# EAGLE design CANTensegrityBoard (EAGLE 6.4)

## Sheet 1 of 6
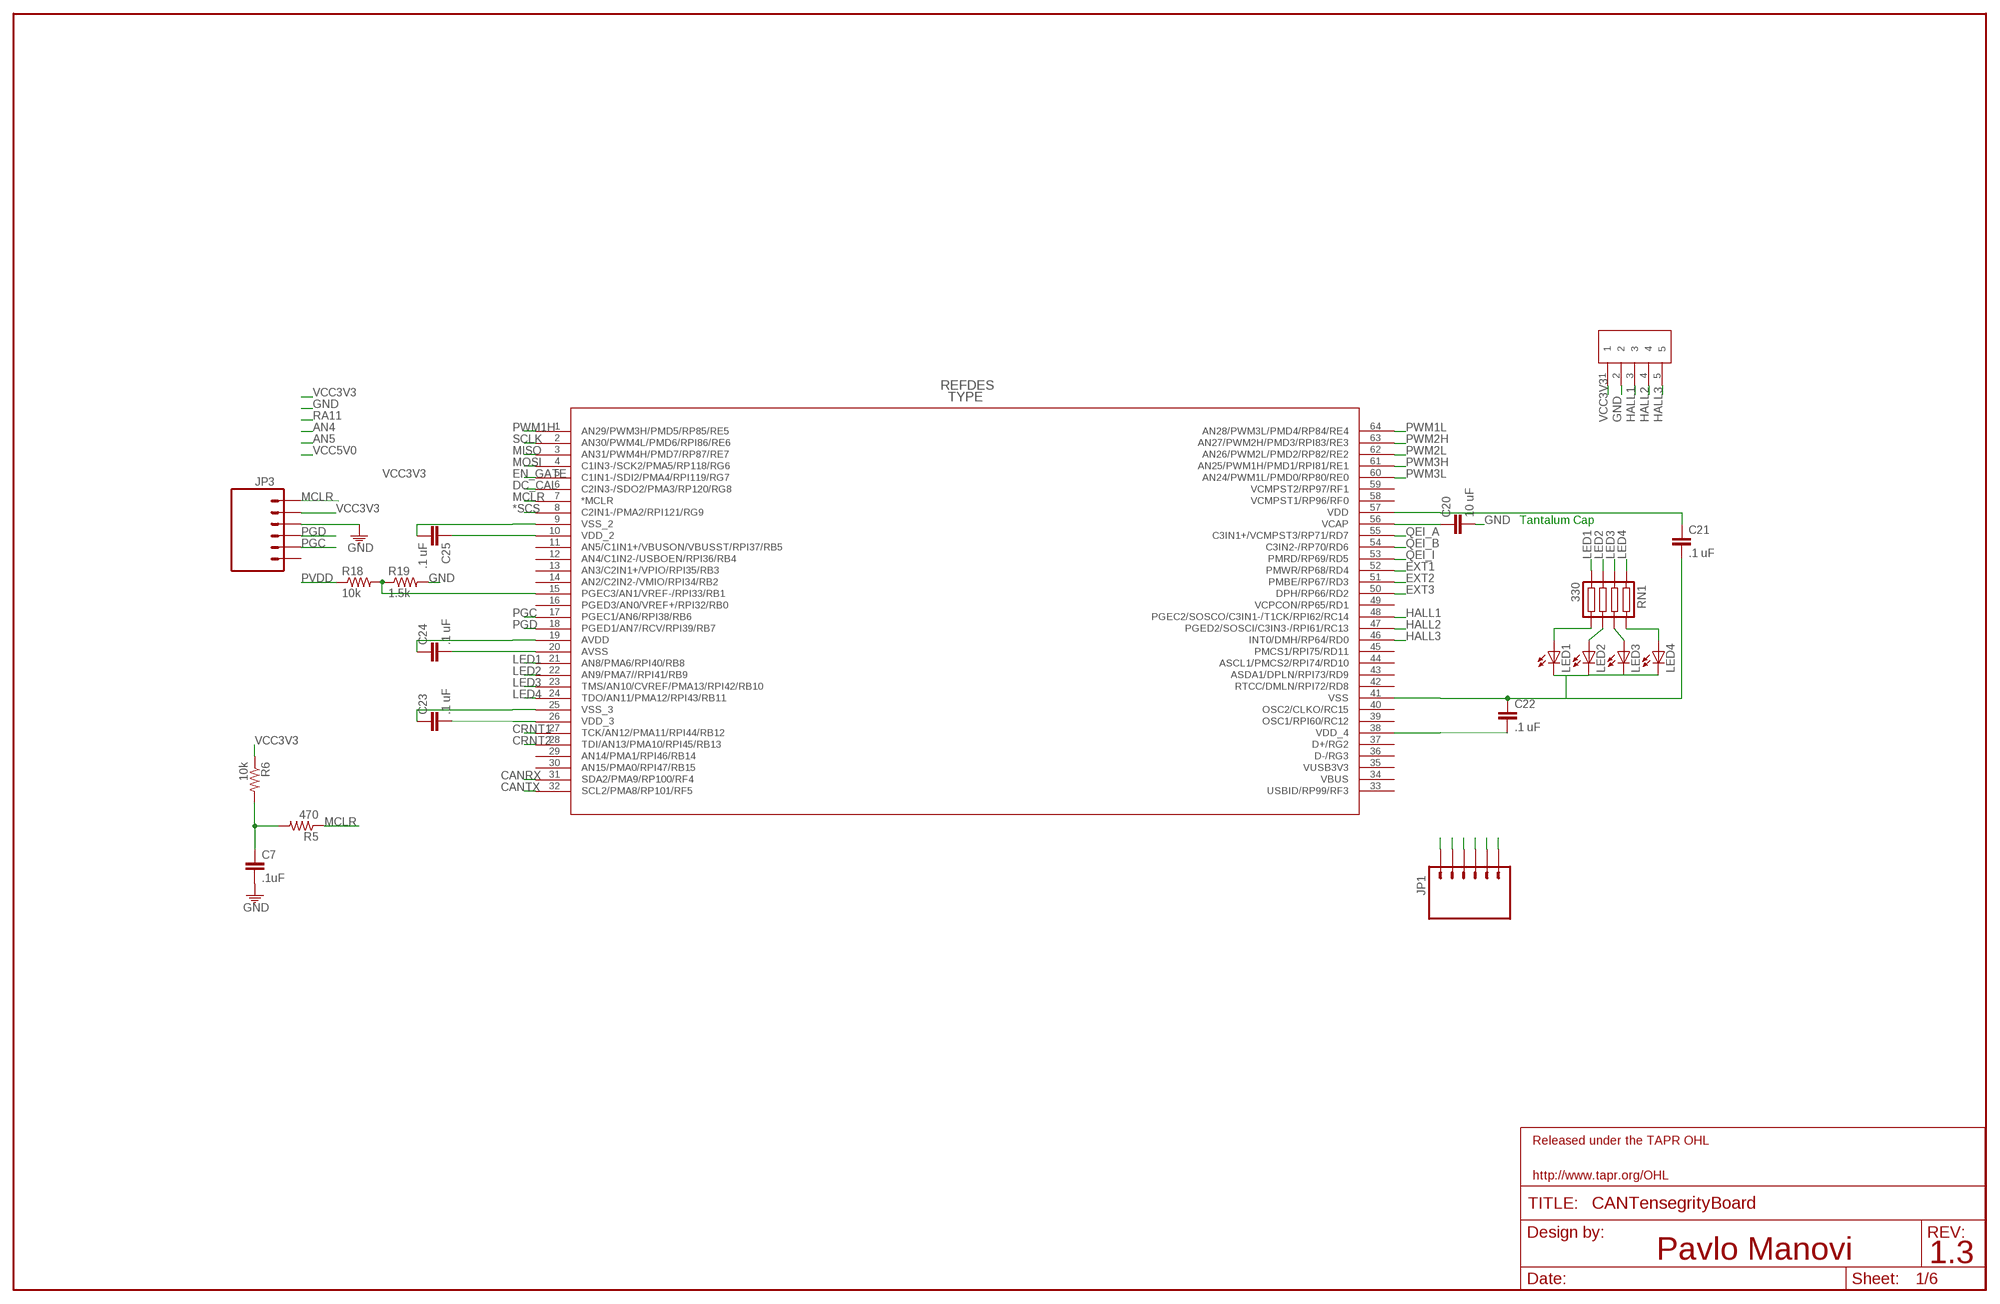
[diagram p0: schematic, sheet 1]

### Parts
C7  .1uF  CAP0805  [0805]
C20  10 uF  CAP1206  [1206]
C21  .1 uF  CAP0805  [0805]
C22  .1 uF  CAP0805  [0805]
C23  .1 uF  CAP0805  [0805]
C24  .1 uF  CAP0805  [0805]
C25  .1 uF  CAP0805  [0805]
JP1  M06DUAL_ROW  [2X03]
JP3  M06LOCK  [1X06_LOCK]
LED1  LED0805  [LED-0805]
LED2  LED0805  [LED-0805]
LED3  LED0805  [LED-0805]
LED4  LED0805  [LED-0805]
R5  470  RESISTOR0805-RES  [0805]
R6  10k  RESISTOR0805-RES  [0805]
R18  10k  RESISTOR0805-RES  [0805]
R19  1.5k  RESISTOR0805-RES  [0805]
RN1  330  RESISTOR_ARRAY-4  [EXB-38V271JV]
U6  DSPIC33EP256MU80  [QFP64-10X10MC]
U$20  MICROCLASP5  [55932-0510]

### Nets
*SCS [Power]: U6.8(C2IN1-/PMA2/RPI121/RG9) ; also sheet 2
CANRX: U6.31(SDA2/PMA9/RP100/RF4) ; also sheet 4
CANTX: U6.32(SCL2/PMA8/RP101/RF5) ; also sheet 4
CRNT1: U6.27(TCK/AN12/PMA11/RPI44/RB12) ; also sheet 2
CRNT2: U6.28(TDI/AN13/PMA10/RPI45/RB13) ; also sheet 2
DC_CAL: U6.6(C2IN3-/SDO2/PMA3/RP120/RG8) ; also sheet 2
EN_GATE: U6.5(C1IN1-/SDI2/PMA4/RPI119/RG7) ; also sheet 2
EXT1: JP1.1 U6.52(PMWR/RP68/RD4)
EXT2: JP1.2 U6.51(PMBE/RP67/RD3)
EXT3: JP1.3 U6.50(DPH/RP66/RD2)
GND: C7.2 C20.2 C21.2 C22.1 C23.1 C24.2 C25.2 JP1.4 JP3.3 LED1.2(C) LED2.2(C) LED3.2(C) LED4.2(C) R19.2 U6.9(VSS_2) U6.20(AVSS) U6.25(VSS_3) U6.41(VSS) U$20.2 ; also sheet 3,4,6
HALL1: U6.48(PGEC2/SOSCO/C3IN1-/T1CK/RPI62/RC14) U$20.3
HALL2: U6.47(PGED2/SOSCI/C3IN3-/RPI61/RC13) U$20.4
HALL3: U6.46(INT0/DMH/RP64/RD0) U$20.5
LED1: RN1.P$4 U6.21(AN8/PMA6/RPI40/RB8)
LED2: RN1.P$3 U6.22(AN9/PMA7//RPI41/RB9)
LED3: RN1.P$2 U6.23(TMS/AN10/CVREF/PMA13/RPI42/RB10)
LED4: RN1.P$1 U6.24(TDO/AN11/PMA12/RPI43/RB11)
MCLR: JP3.1 R5.1 U6.7(*MCLR)
MISO: U6.3(AN31/PWM4H/PMD7/RP87/RE7) ; also sheet 2
MOSI: U6.4(C1IN3-/SCK2/PMA5/RP118/RG6) ; also sheet 2
N$2: C7.1 R5.2 R6.2
N$25: R18.2 R19.1 U6.15(PGEC3/AN1/VREF-/RPI33/RB1)
N$31: C20.1 U6.56(VCAP)
N$44: LED1.1(A) RN1.P$5
N$45: LED2.1(A) RN1.P$6
N$46: LED3.1(A) RN1.P$7
N$47: LED4.1(A) RN1.P$8
PGC: JP3.5 U6.17(PGEC1/AN6/RPI38/RB6)
PGD [small]: JP3.4 U6.18(PGED1/AN7/RCV/RPI39/RB7)
PVDD [Power]: R18.1 ; also sheet 2,3,5
PWM1H: U6.1(AN29/PWM3H/PMD5/RP85/RE5) ; also sheet 2
PWM1L: U6.64(AN28/PWM3L/PMD4/RP84/RE4) ; also sheet 2
PWM2H: U6.63(AN27/PWM2H/PMD3/RPI83/RE3) ; also sheet 2
PWM2L: U6.62(AN26/PWM2L/PMD2/RP82/RE2) ; also sheet 2
PWM3H: U6.61(AN25/PWM1H/PMD1/RPI81/RE1) ; also sheet 2
PWM3L: U6.60(AN24/PWM1L/PMD0/RP80/RE0) ; also sheet 2
QEI_A: U6.55(C3IN1+/VCMPST3/RP71/RD7) ; also sheet 6
QEI_B: U6.54(C3IN2-/RP70/RD6) ; also sheet 6
QEI_I: U6.53(PMRD/RP69/RD5) ; also sheet 6
SCLK: U6.2(AN30/PWM4L/PMD6/RPI86/RE6) ; also sheet 2
VCC3V3 [Power]: C21.1 C22.2 C23.2 C24.1 C25.1 JP1.6 JP3.2 R6.1 U6.10(VDD_2) U6.19(AVDD) U6.26(VDD_3) U6.38(VDD_4) U6.57(VDD) U$20.1 ; also sheet 2,4,5,6
VCC5V0: JP1.5 ; also sheet 5,6
Unconnected: JP3.6 U6.11(AN5/C1IN1+/VBUSON/VBUSST/RPI37/RB5) U6.12(AN4/C1IN2-/USBOEN/RPI36/RB4) U6.13(AN3/C2IN1+/VPIO/RPI35/RB3) U6.14(AN2/C2IN2-/VMIO/RPI34/RB2) U6.16(PGED3/AN0/VREF+/RPI32/RB0) U6.29(AN14/PMA1/RPI46/RB14) U6.30(AN15/PMA0/RPI47/RB15) U6.33(USBID/RP99/RF3) U6.34(VBUS) U6.35(VUSB3V3) U6.36(D-/RG3) U6.37(D+/RG2) U6.39(OSC1/RPI60/RC12) U6.40(OSC2/CLKO/RC15) U6.42(RTCC/DMLN/RPI72/RD8) U6.43(ASDA1/DPLN/RPI73/RD9) U6.44(ASCL1/PMCS2/RPI74/RD10) U6.45(PMCS1/RPI75/RD11) U6.49(VCPCON/RP65/RD1) U6.58(VCMPST1/RP96/RF0) U6.59(VCMPST2/RP97/RF1)

### Notes on the sheet
- Tantalum Cap

## Sheet 2 of 6
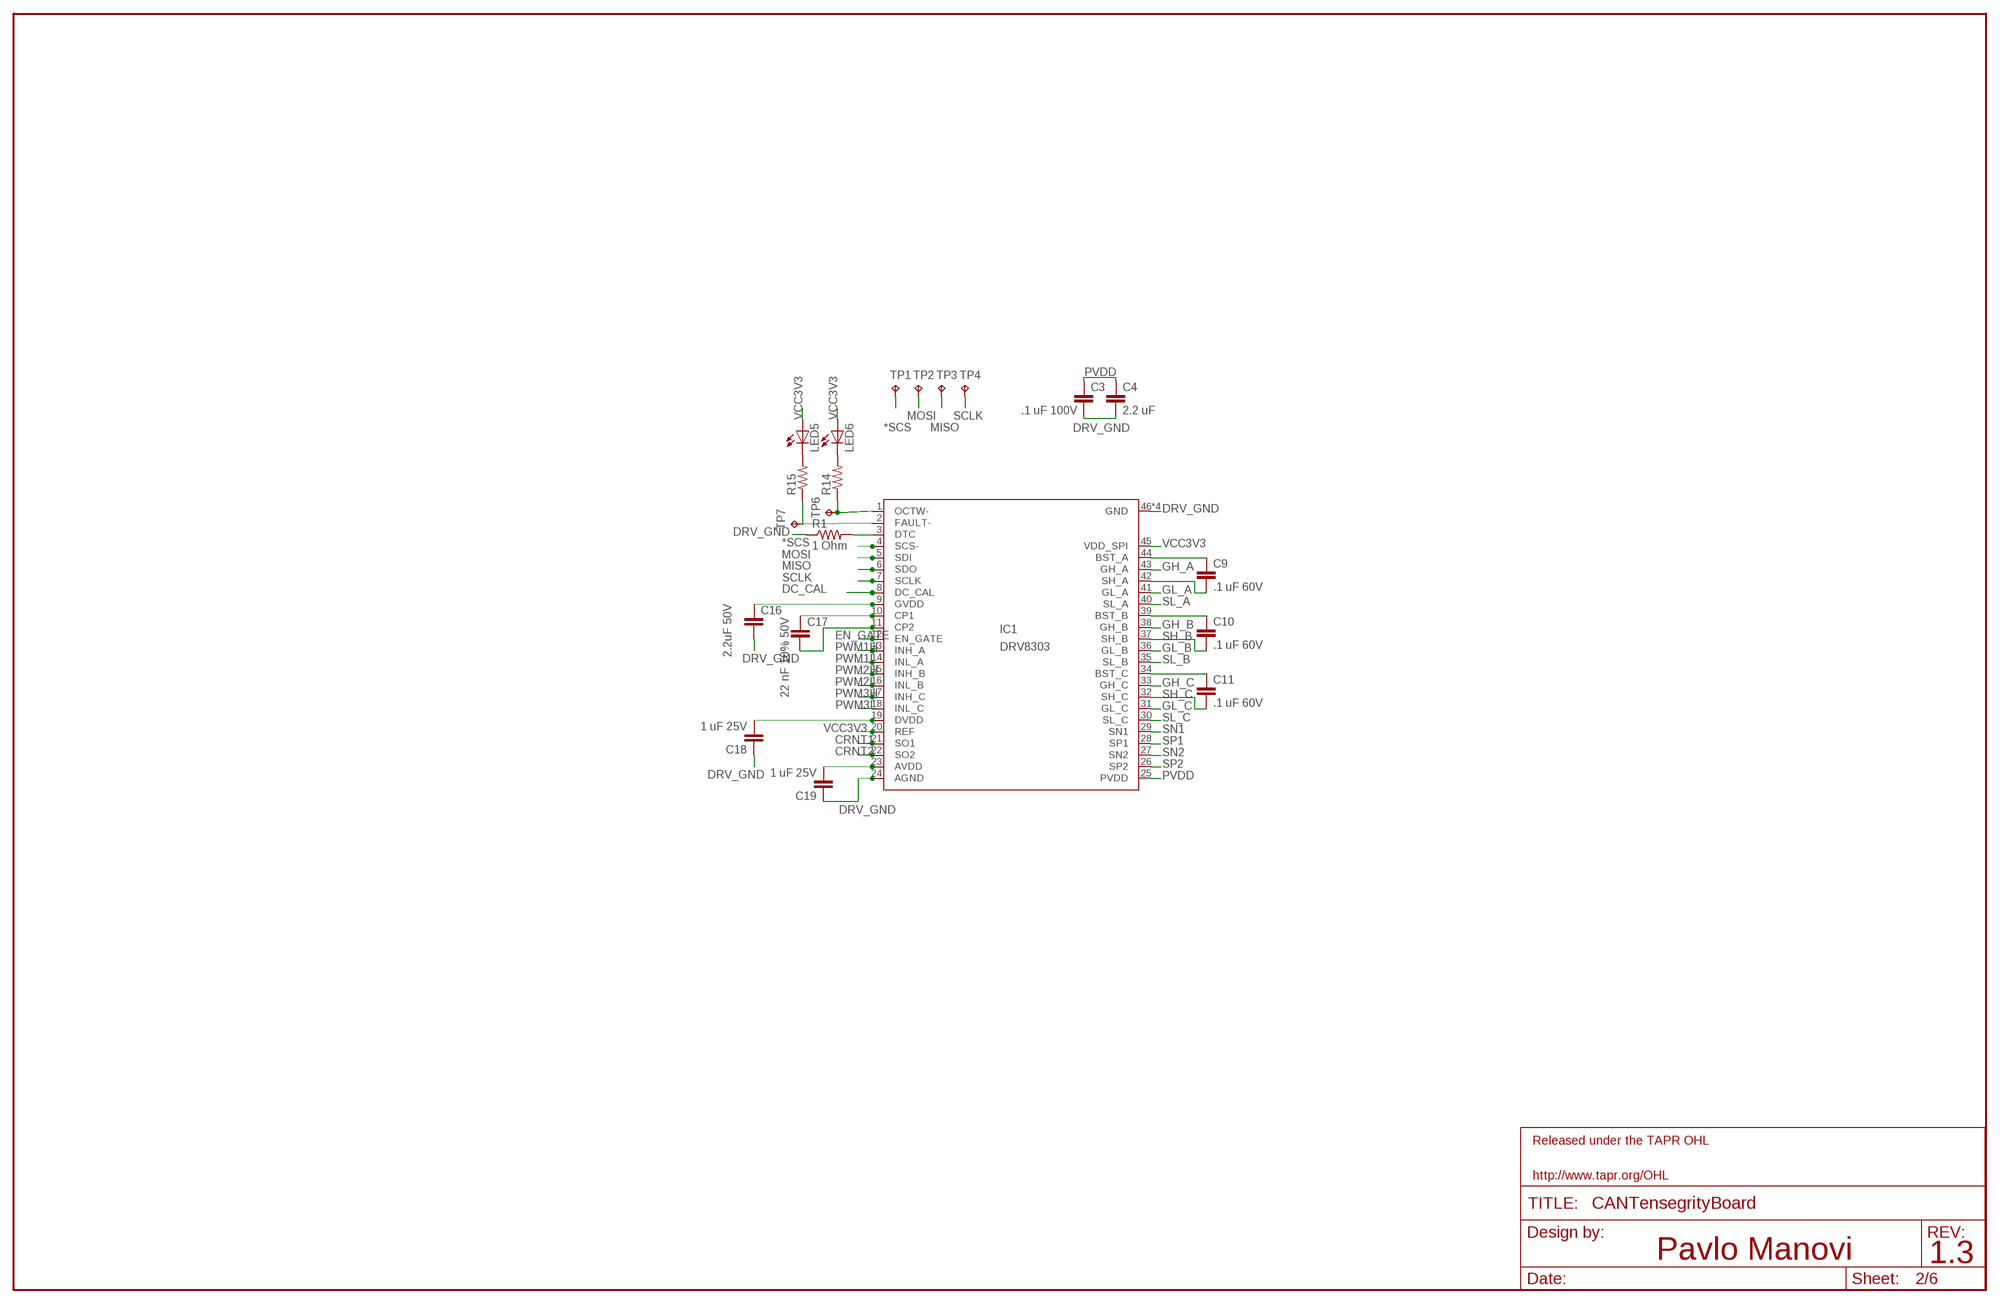
[diagram p1: schematic, sheet 2]

### Parts
C3  .1 uF 100V  CAP0805  [0805]
C4  2.2 uF  CAP0805  [0805]
C9  .1 uF 60V  CAP0805  [0805]
C10  .1 uF 60V  CAP0805  [0805]
C11  .1 uF 60V  CAP0805  [0805]
C16  2.2uF 50V  CAP1206  [1206]
C17  22 nF 10% 50V  CAP0805  [0805]
C18  1 uF 25V  CAP0805  [0805]
C19  1 uF 25V  CAP0805  [0805]
IC1  DRV8303  [HTSSOP-480-DCA]
LED5  LED0805  [LED-0805]
LED6  LED0805  [LED-0805]
R1  1 Ohm  RESISTOR0805-RES  [0805]
R14  RESISTOR0805-RES  [0805]
R15  RESISTOR0805-RES  [0805]
TP1  TPTP06R  [TP06R]
TP2  TPTP06R  [TP06R]
TP3  TPTP06R  [TP06R]
TP4  TPTP06R  [TP06R]
TP6  TPTP06R  [TP06R]
TP7  TPTP06R  [TP06R]

### Nets
*SCS [Power]: IC1.4(SCS-) TP1.TP ; also sheet 1
BST_B: C10.1 IC1.39(BST_B)
BST_C: C11.1 IC1.34(BST_C)
CRNT1: IC1.21(SO1) ; also sheet 1
CRNT2: IC1.22(SO2) ; also sheet 1
DC_CAL: IC1.8(DC_CAL) ; also sheet 1
DRV_GND [Power]: C3.2 C4.2 C16.2 C18.1 C19.1 IC1.24(AGND) IC1.46(GND) IC1.47(GND) IC1.48(GND) IC1.49(GND) R1.1 ; also sheet 3
EN_GATE: IC1.12(EN_GATE) ; also sheet 1
GH_A: IC1.43(GH_A) ; also sheet 3
GH_B: IC1.38(GH_B) ; also sheet 3
GH_C: IC1.33(GH_C) ; also sheet 3
GL_A: IC1.41(GL_A) ; also sheet 3
GL_B: IC1.36(GL_B) ; also sheet 3
GL_C: IC1.31(GL_C) ; also sheet 3
MISO: IC1.6(SDO) TP3.TP ; also sheet 1
MOSI: IC1.5(SDI) TP2.TP ; also sheet 1
N$1: IC1.3(DTC) R1.2
N$4: C9.1 IC1.44(BST_A)
N$11: LED5.2(C) R15.2
N$12: IC1.1(OCTW-) R14.1 TP6.TP
N$17: LED6.2(C) R14.2
N$18: C16.1 IC1.9(GVDD)
N$19: C17.1 IC1.10(CP1)
N$20: C17.2 IC1.11(CP2)
N$21: C18.2 IC1.19(DVDD)
N$22: C19.2 IC1.23(AVDD)
N$24: IC1.2(FAULT-) R15.1 TP7.TP
PVDD [Power]: C3.1 C4.1 IC1.25(PVDD) ; also sheet 1,3,5
PWM1H: IC1.13(INH_A) ; also sheet 1
PWM1L: IC1.14(INL_A) ; also sheet 1
PWM2H: IC1.15(INH_B) ; also sheet 1
PWM2L: IC1.16(INL_B) ; also sheet 1
PWM3H: IC1.17(INH_C) ; also sheet 1
PWM3L: IC1.18(INL_C) ; also sheet 1
SCLK: IC1.7(SCLK) TP4.TP ; also sheet 1
SH_A: C9.2 IC1.42(SH_A) ; also sheet 3
SH_B: C10.2 IC1.37(SH_B) ; also sheet 3
SH_C: C11.2 IC1.32(SH_C) ; also sheet 3
SL_A: IC1.40(SL_A) ; also sheet 3
SL_B [Power]: IC1.35(SL_B) ; also sheet 3
SL_C: IC1.30(SL_C) ; also sheet 3
SN1: IC1.29(SN1) ; also sheet 3
SN2: IC1.27(SN2) ; also sheet 3
SP1 [Power]: IC1.28(SP1) ; also sheet 3
SP2 [Power]: IC1.26(SP2) ; also sheet 3
VCC3V3 [Power]: IC1.20(REF) IC1.45(VDD_SPI) LED5.1(A) LED6.1(A) ; also sheet 1,4,5,6

## Sheet 3 of 6
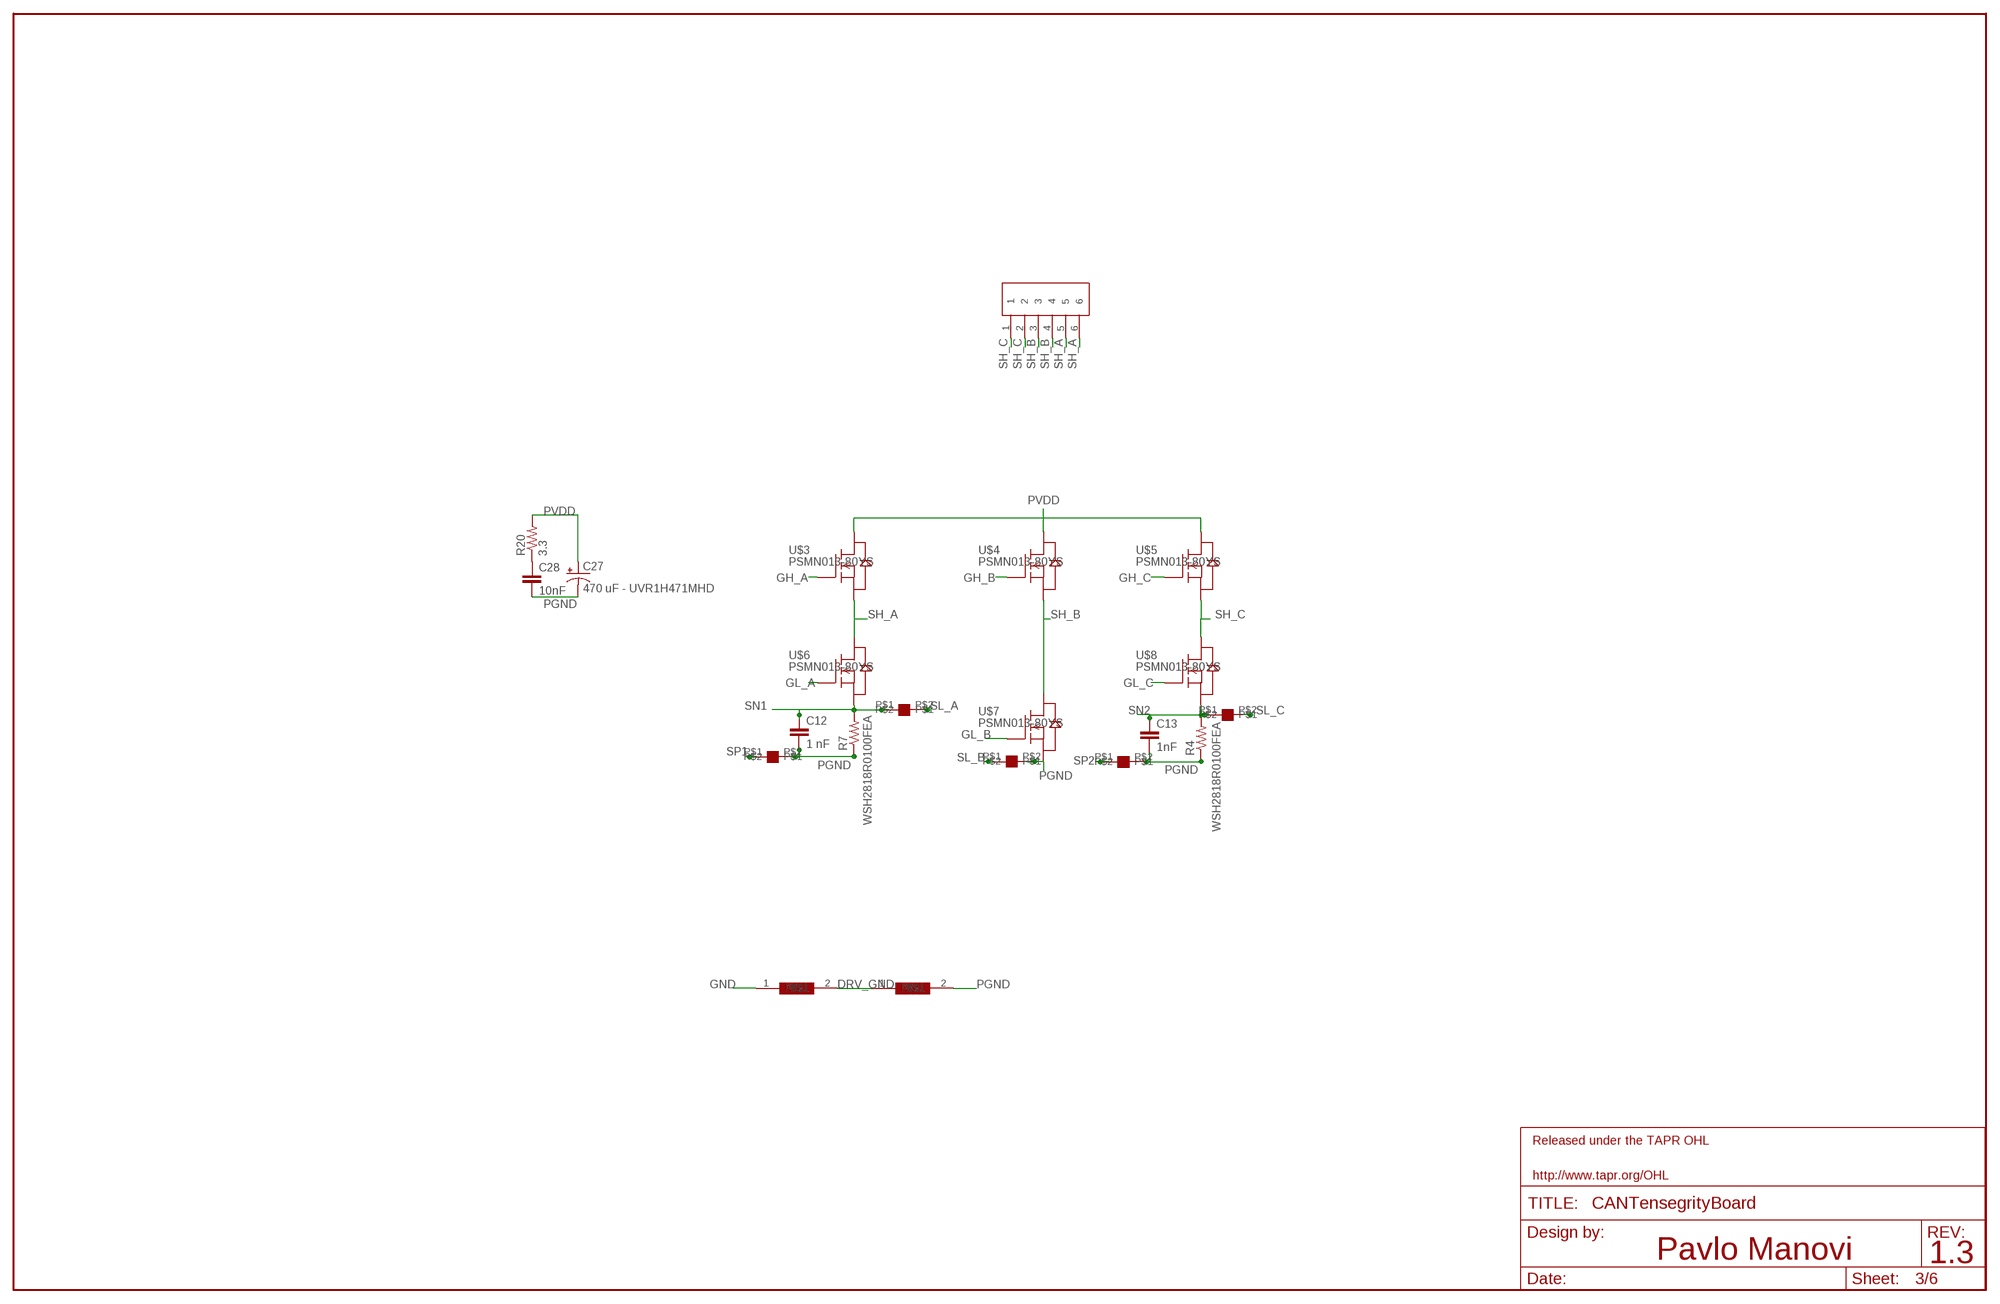
[diagram p2: schematic, sheet 3]

### Parts
C12  1 nF  CAP0805  [0805]
C13  1nF  CAP0805  [0805]
C27  470 uF - UVR1H471MHD  CAP_POLPTH4  [CPOL-RADIAL-1000UF-25V]
C28  10nF  CAP0805  [0805]
R4  WSH2818R0100FEA  RESISTOR  [SMT-REF]
R7  WSH2818R0100FEA  RESISTOR  [SMT-REF]
R20  3.3  RESISTOR0805-RES  [0805]
U9  H1206T500R-10  [1206]
U10  H1206T500R-10  [1206]
U$2  NETJUMPER  [NETJUMPER]
U$3  PSMN013-80YS  [TO127P600X120-5N]
U$4  PSMN013-80YS  [TO127P600X120-5N]
U$5  PSMN013-80YS  [TO127P600X120-5N]
U$6  PSMN013-80YS  [TO127P600X120-5N]
U$7  PSMN013-80YS  [TO127P600X120-5N]
U$8  PSMN013-80YS  [TO127P600X120-5N]
U$9  NETJUMPER  [NETJUMPER]
U$10  NETJUMPER  [NETJUMPER]
U$11  NETJUMPER  [NETJUMPER]
U$12  NETJUMPER  [NETJUMPER]
U$17  MINIFITJR6PIN  [0039288060]

### Nets
DRV_GND [Power]: U9.2 U10.1 ; also sheet 2
GH_A: U$3.4(G) ; also sheet 2
GH_B: U$4.4(G) ; also sheet 2
GH_C: U$5.4(G) ; also sheet 2
GL_A: U$6.4(G) ; also sheet 2
GL_B: U$7.4(G) ; also sheet 2
GL_C: U$8.4(G) ; also sheet 2
GND: U9.1 ; also sheet 1,4,6
N$6: C28.1 R20.1
PGND [Power]: C12.2 C13.2 C27.2(-) C28.2 R4.1 R7.1 U10.2 U$2.P$2 U$7.1(S) U$7.2(S) U$7.3(S) U$10.P$2 U$11.P$2 ; also sheet 5
PVDD [Power]: C27.1(+) R20.2 U$3.5(D) U$3.P$1(D) U$3.P$2(D) U$3.P$3(D) U$3.P$4(D) U$3.P$5(D) U$3.P$6(D) U$3.P$7(D) U$3.P$8(D) U$3.P$9(D) U$4.5(D) U$4.P$1(D) U$4.P$2(D) U$4.P$3(D) U$4.P$4(D) U$4.P$5(D) U$4.P$6(D) U$4.P$7(D) U$4.P$8(D) U$4.P$9(D) U$5.5(D) U$5.P$1(D) U$5.P$2(D) U$5.P$3(D) U$5.P$4(D) U$5.P$5(D) U$5.P$6(D) U$5.P$7(D) U$5.P$8(D) U$5.P$9(D) ; also sheet 1,2,5
SH_A: U$3.1(S) U$3.2(S) U$3.3(S) U$6.5(D) U$6.P$1(D) U$6.P$2(D) U$6.P$3(D) U$6.P$4(D) U$6.P$5(D) U$6.P$6(D) U$6.P$7(D) U$6.P$8(D) U$6.P$9(D) U$17.5 U$17.6 ; also sheet 2
SH_B: U$4.1(S) U$4.2(S) U$4.3(S) U$7.5(D) U$7.P$1(D) U$7.P$2(D) U$7.P$3(D) U$7.P$4(D) U$7.P$5(D) U$7.P$6(D) U$7.P$7(D) U$7.P$8(D) U$7.P$9(D) U$17.3 U$17.4 ; also sheet 2
SH_C: U$5.1(S) U$5.2(S) U$5.3(S) U$8.5(D) U$8.P$1(D) U$8.P$2(D) U$8.P$3(D) U$8.P$4(D) U$8.P$5(D) U$8.P$6(D) U$8.P$7(D) U$8.P$8(D) U$8.P$9(D) U$17.1 U$17.2 ; also sheet 2
SL_A: U$9.P$2 ; also sheet 2
SL_B [Power]: U$10.P$1 ; also sheet 2
SL_C: U$12.P$2 ; also sheet 2
SN1: C12.1 R7.2 U$6.1(S) U$6.2(S) U$6.3(S) U$9.P$1 ; also sheet 2
SN2: C13.1 R4.2 U$8.1(S) U$8.2(S) U$8.3(S) U$12.P$1 ; also sheet 2
SP1 [Power]: U$2.P$1 ; also sheet 2
SP2 [Power]: U$11.P$1 ; also sheet 2

## Sheet 4 of 6
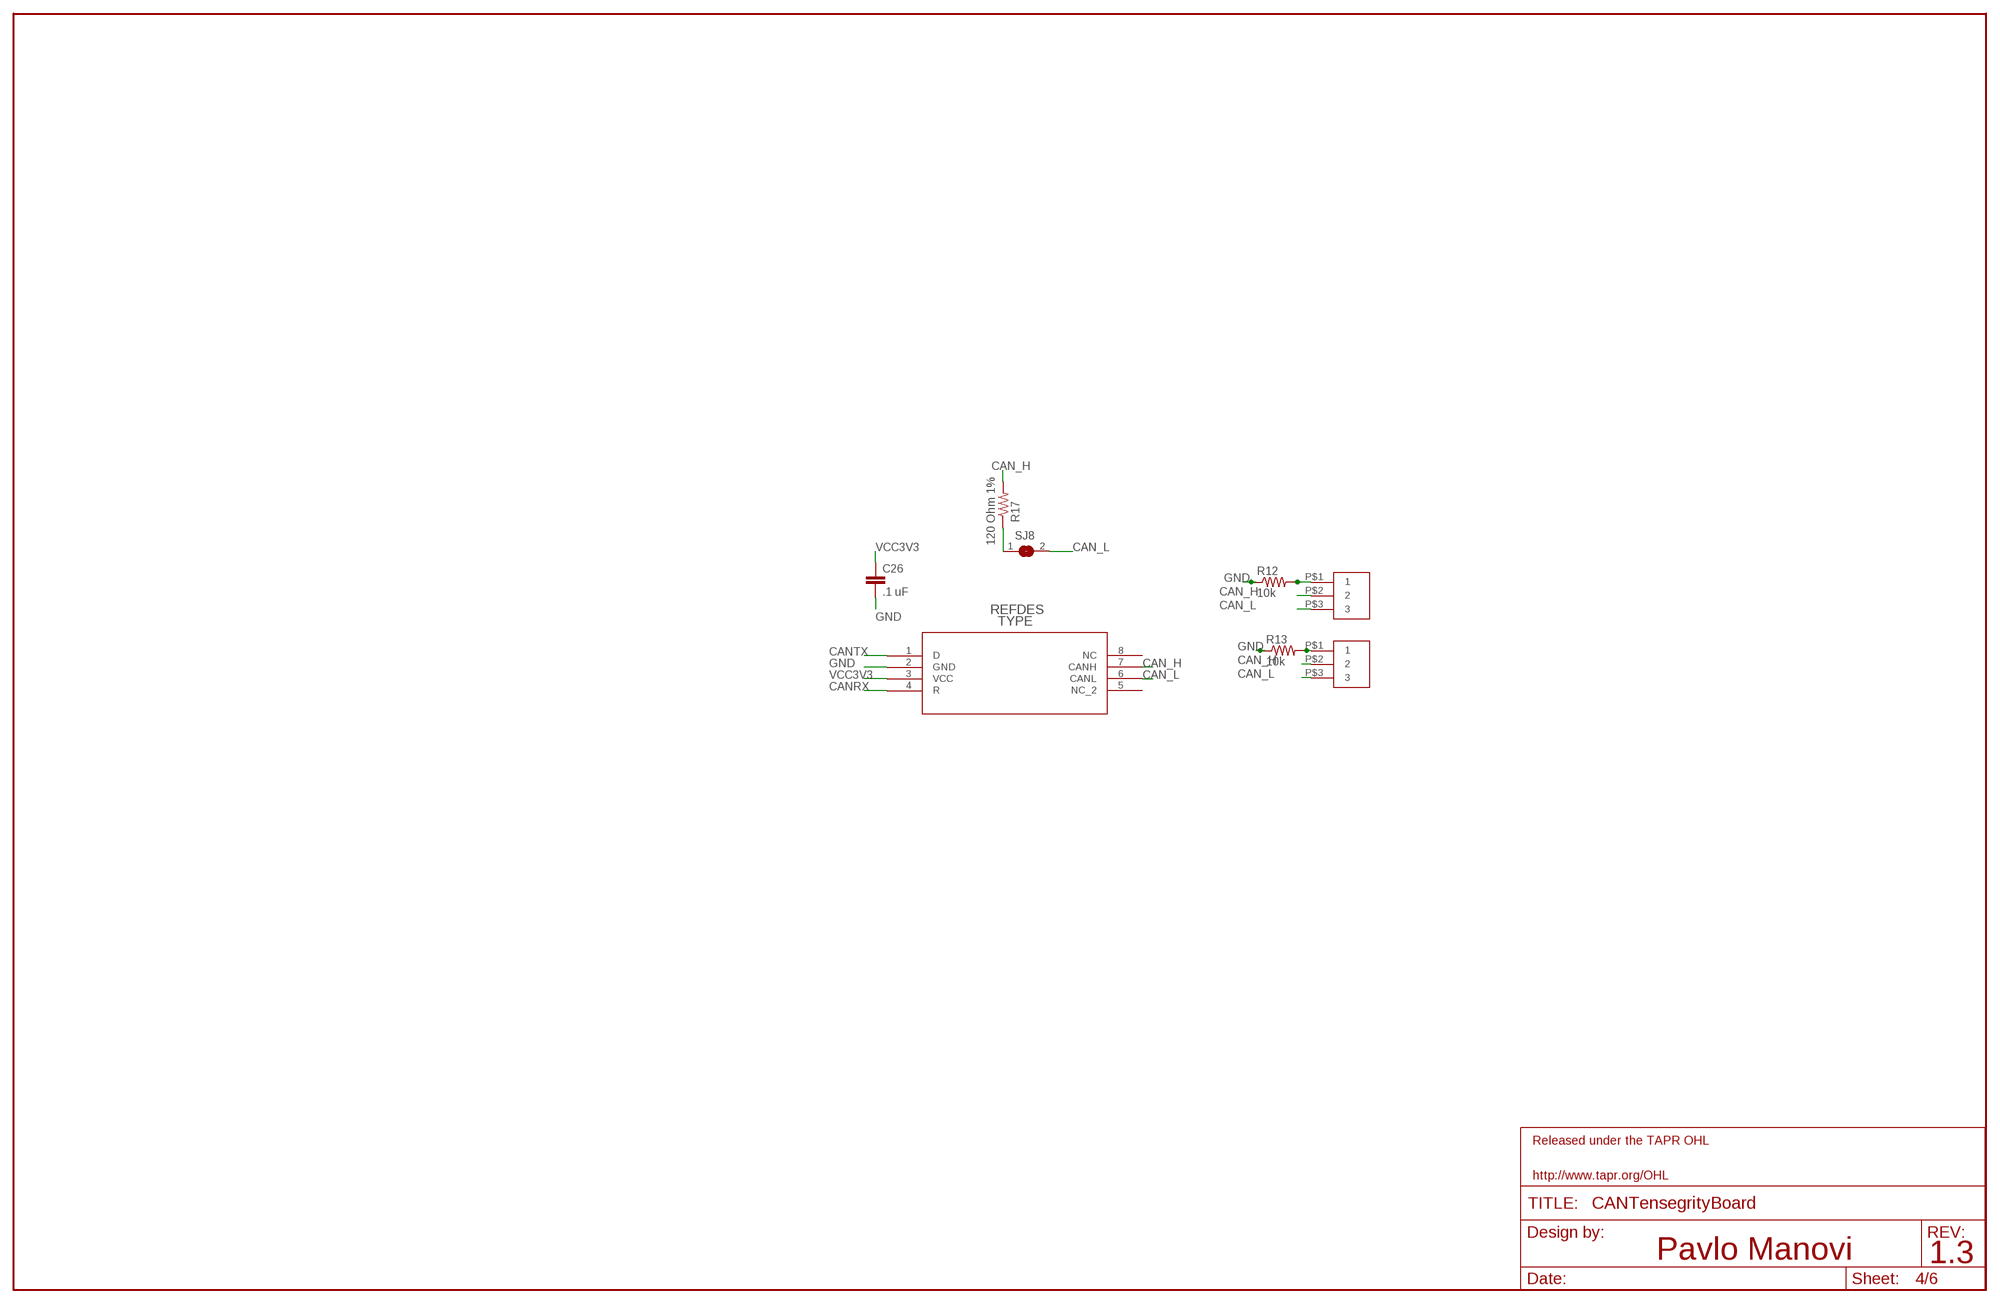
[diagram p3: schematic, sheet 4]

### Parts
C26  .1 uF  CAP0805  [0805]
R12  10k  RESISTOR0805-RES  [0805]
R13  10k  RESISTOR0805-RES  [0805]
R17  120 Ohm 1%  RESISTOR0805-RES  [0805]
SJ8  SJ  [SJ]
U2  SN65HVD232_D_8  [D8]
U$14  MICROCLASP3  [55932-0310]
U$19  MICROCLASP3  [55932-0310]

### Nets
CAN_H: R17.2 U2.7(CANH) U$14.P$2 U$19.P$2
CAN_L: SJ8.2 U2.6(CANL) U$14.P$3 U$19.P$3
CANRX: U2.4(R) ; also sheet 1
CANTX: U2.1(D) ; also sheet 1
GND: C26.2 R12.1 R13.1 U2.2(GND) ; also sheet 1,3,6
N$27: R12.2 U$19.P$1
N$28: R13.2 U$14.P$1
N$64: R17.1 SJ8.1
VCC3V3 [Power]: C26.1 U2.3(VCC) ; also sheet 1,2,5,6
Unconnected: U2.5(NC_2) U2.8(NC)

## Sheet 5 of 6
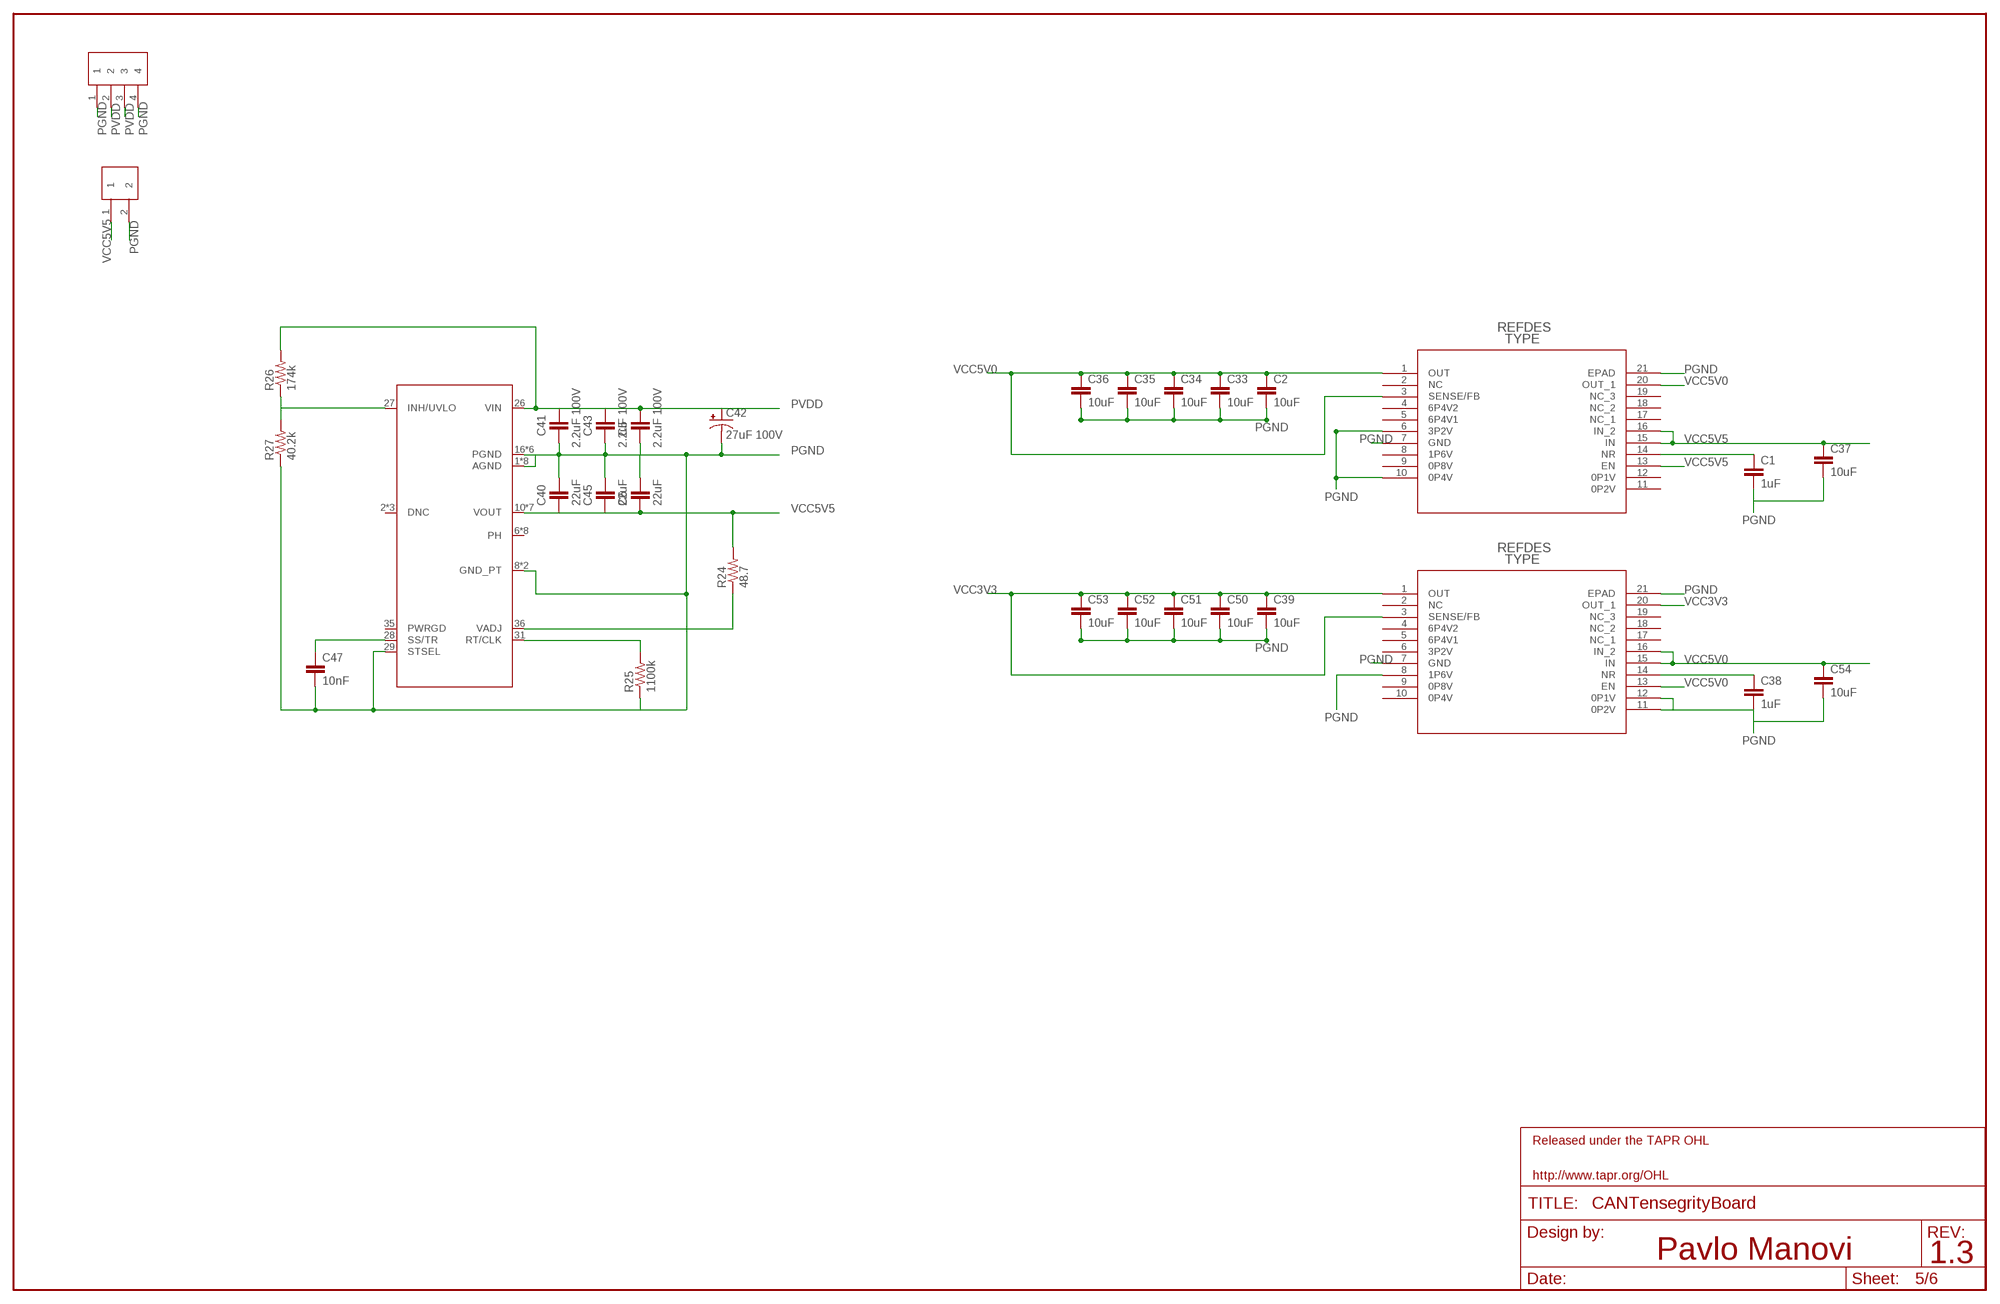
[diagram p4: schematic, sheet 5]

### Parts
C1  1uF  CAP0805  [0805]
C2  10uF  CAP0805  [0805]
C5  2.2uF 100V  CAP1210  [1210]
C6  22uF  CAP1210  [1210]
C33  10uF  CAP0805  [0805]
C34  10uF  CAP0805  [0805]
C35  10uF  CAP0805  [0805]
C36  10uF  CAP0805  [0805]
C37  10uF  CAP0805  [0805]
C38  1uF  CAP0805  [0805]
C39  10uF  CAP0805  [0805]
C40  22uF  CAP1210  [1210]
C41  2.2uF 100V  CAP1210  [1210]
C42  27uF 100V  CAP_POLPTH1  [CPOL-RADIAL-100UF-25V]
C43  2.2uF 100V  CAP1210  [1210]
C45  22uF  CAP1210  [1210]
C47  10nF  CAP0805  [0805]
C50  10uF  CAP0805  [0805]
C51  10uF  CAP0805  [0805]
C52  10uF  CAP0805  [0805]
C53  10uF  CAP0805  [0805]
C54  10uF  CAP0805  [0805]
R24  48.7  RESISTOR0805-RES  [0805]
R25  1100k  RESISTOR0805-RES  [0805]
R26  174k  RESISTOR0805-RES  [0805]
R27  40.2k  RESISTOR0805-RES  [0805]
U7  TPS84250_RKG_41  [RKG41]
U$1  TPS7A4700_RGW_20  [RGW20_3P15X3P15]
U$16  MINIFITJR4PIN  [0039288040]
U$18  MICROCLASP2  [55932-0210]
U$22  TPS7A4700_RGW_20  [RGW20_3P15X3P15]

### Nets
N$5: C1.1 U$1.14(NR)
N$23: C38.1 U$22.14(NR)
N$37: R24.1 U7.36(VADJ)
N$38: R25.2 U7.31(RT/CLK)
N$41: R26.1 R27.2 U7.27(INH/UVLO)
N$43: C47.1 U7.28(SS/TR)
PGND [Power]: C1.2 C2.2 C5.2 C6.1 C33.2 C34.2 C35.2 C36.2 C37.2 C38.2 C39.2 C40.1 C41.2 C42.2(-) C43.2 C45.1 C47.2 C50.2 C51.2 C52.2 C53.2 C54.2 R25.1 R27.1 U7.1(AGND) U7.4(AGND) U7.5(AGND) U7.8(GND_PT) U7.9(GND_PT) U7.16(PGND) U7.17(PGND) U7.18(PGND) U7.19(PGND) U7.20(PGND) U7.29(STSEL) U7.30(AGND) U7.32(AGND) U7.33(AGND) U7.34(AGND) U7.37(AGND) U7.40(PGND) U$1.6(3P2V) U$1.7(GND) U$1.10(0P4V) U$1.21(EPAD) U$16.1 U$16.4 U$18.2 U$22.7(GND) U$22.8(1P6V) U$22.11(0P2V) U$22.12(0P1V) U$22.21(EPAD) ; also sheet 3
PVDD [Power]: C5.1 C41.1 C42.1(+) C43.1 R26.2 U7.26(VIN) U$16.2 U$16.3 ; also sheet 1,2,3
VCC3V3 [Power]: C39.1 C50.1 C51.1 C52.1 C53.1 U$22.1(OUT) U$22.3(SENSE/FB) U$22.20(OUT_1) ; also sheet 1,2,4,6
VCC5V0: C2.1 C33.1 C34.1 C35.1 C36.1 C54.1 U$1.1(OUT) U$1.3(SENSE/FB) U$1.20(OUT_1) U$22.13(EN) U$22.15(IN) U$22.16(IN_2) ; also sheet 1,6
VCC5V5: C6.2 C37.1 C40.2 C45.2 R24.2 U7.10(VOUT) U7.11(VOUT) U7.12(VOUT) U7.13(VOUT) U7.14(VOUT) U7.15(VOUT) U7.39(VOUT) U$1.13(EN) U$1.15(IN) U$1.16(IN_2) U$18.1
Unconnected: U7.2(DNC) U7.3(DNC) U7.6(PH) U7.7(PH) U7.21(PH) U7.22(PH) U7.23(PH) U7.24(PH) U7.25(DNC) U7.35(PWRGD) U7.38(PH) U7.41(PH) U$1.2(NC) U$1.4(6P4V2) U$1.5(6P4V1) U$1.8(1P6V) U$1.9(0P8V) U$1.11(0P2V) U$1.12(0P1V) U$1.17(NC_1) U$1.18(NC_2) U$1.19(NC_3) U$22.2(NC) U$22.4(6P4V2) U$22.5(6P4V1) U$22.6(3P2V) U$22.9(0P8V) U$22.10(0P4V) U$22.17(NC_1) U$22.18(NC_2) U$22.19(NC_3)

## Sheet 6 of 6
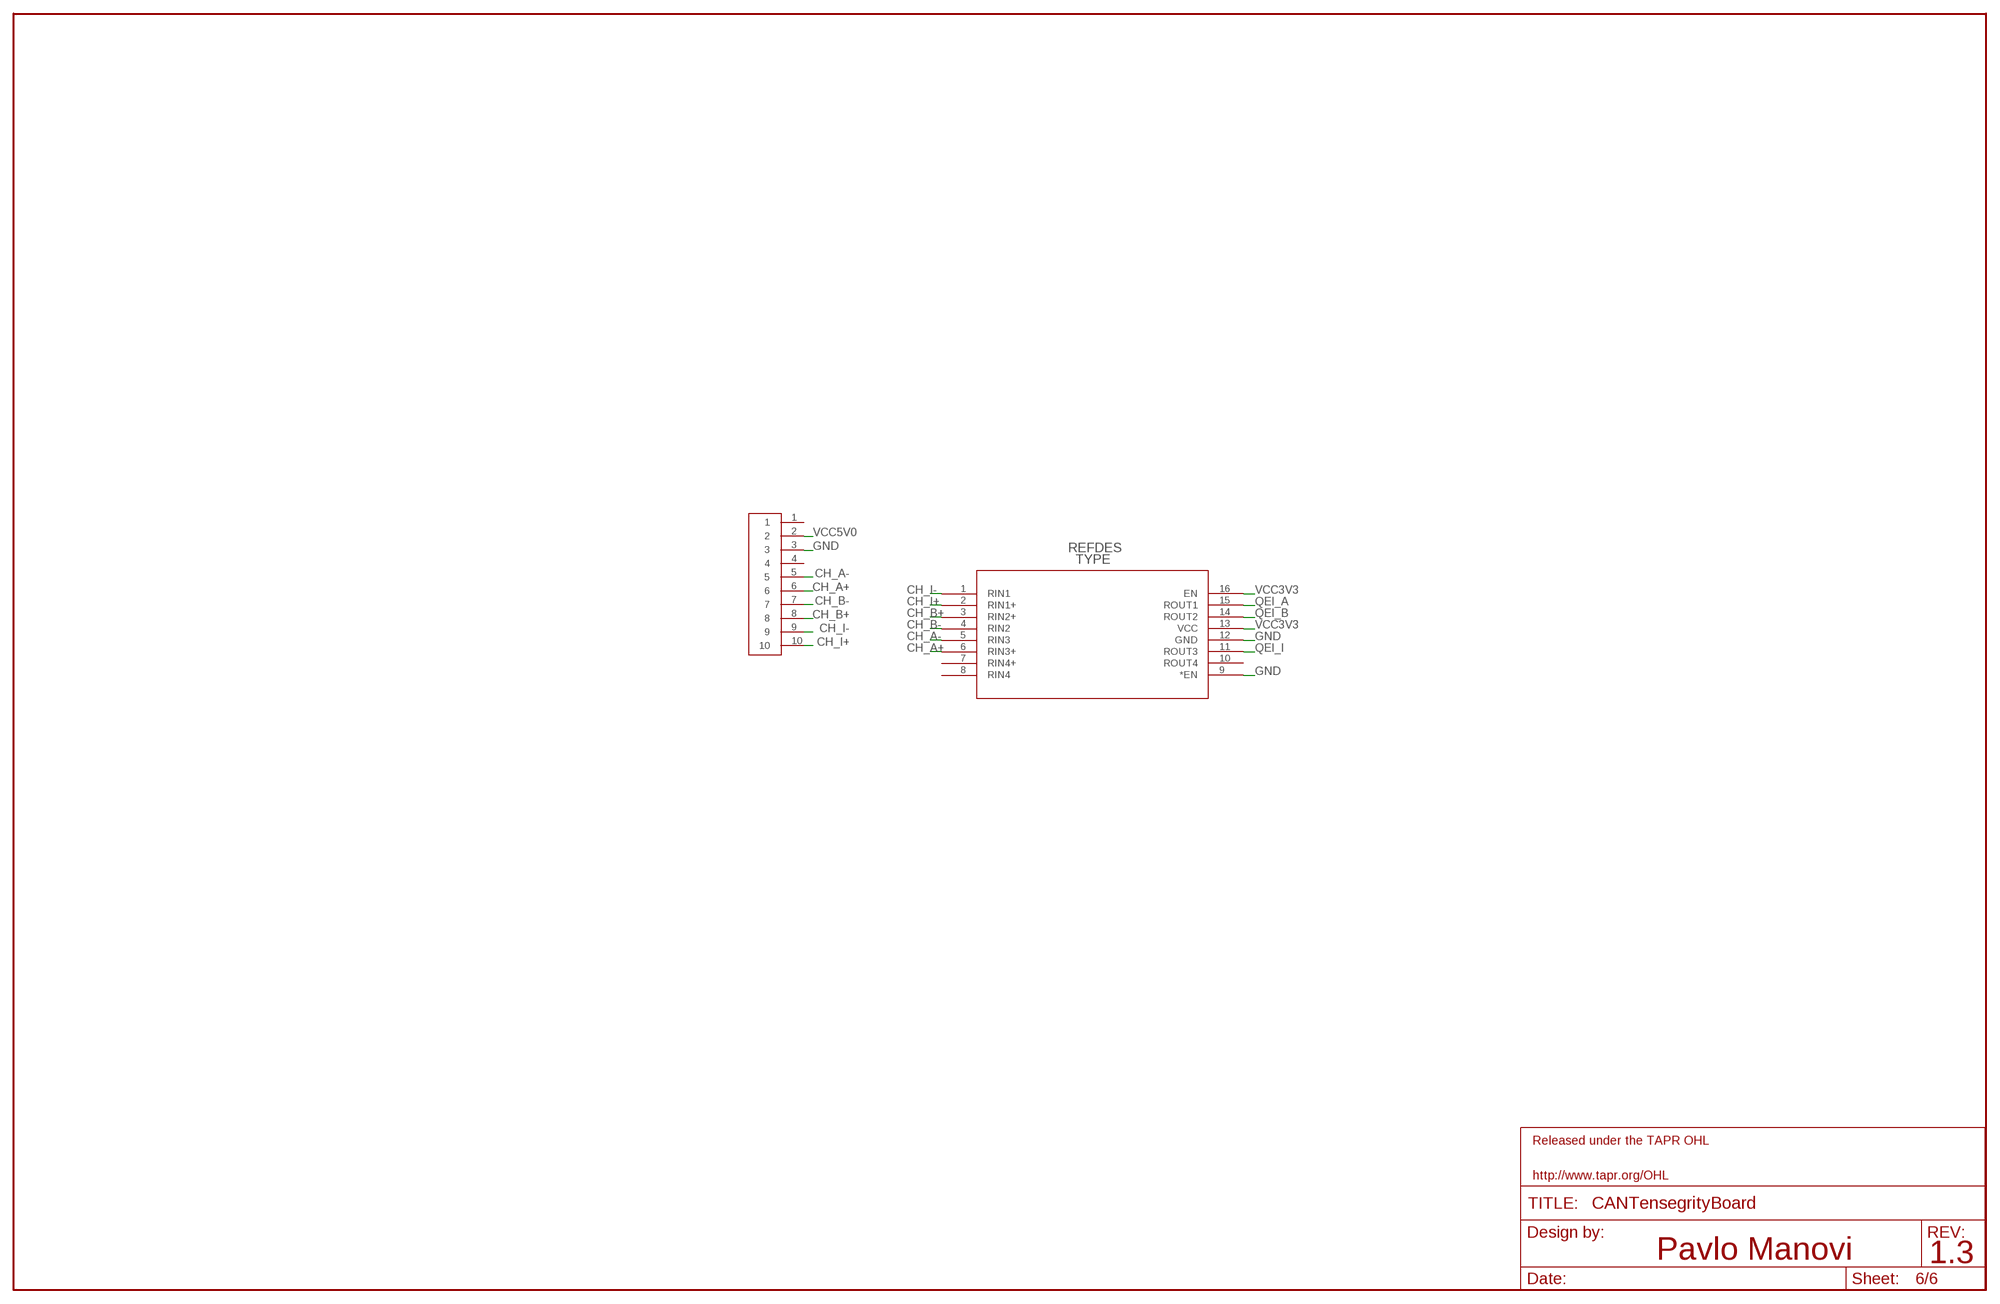
[diagram p5: schematic, sheet 6]

### Parts
U3  SN65LVDT348_PW_1  [PW16]
U$21  3M10PIN2500  [FOUR-WALL-2500-LP-STH]

### Nets
CH_A+: U3.6(RIN3+) U$21.6
CH_A-: U3.5(RIN3) U$21.5
CH_B+: U3.3(RIN2+) U$21.8
CH_B-: U3.4(RIN2) U$21.7
CH_I+: U3.2(RIN1+) U$21.10
CH_I-: U3.1(RIN1) U$21.9
GND: U3.9(*EN) U3.12(GND) U$21.3 ; also sheet 1,3,4
QEI_A: U3.15(ROUT1) ; also sheet 1
QEI_B: U3.14(ROUT2) ; also sheet 1
QEI_I: U3.11(ROUT3) ; also sheet 1
VCC3V3 [Power]: U3.13(VCC) U3.16(EN) ; also sheet 1,2,4,5
VCC5V0: U$21.2 ; also sheet 1,5
Unconnected: U3.7(RIN4+) U3.8(RIN4) U3.10(ROUT4) U$21.1 U$21.4

## Library data of the parts
C1 C2 C5 C6 C33-C41 C43 C45 C47 C50-C54 = SensorCape:CAP: Capacitor Standard 0603 ceramic capacitor, and 0.1" leaded capacitor.
C3 C4 C7 C9-C13 C16-C26 C28 = ASL:CAP: Capacitor Standard 0603 ceramic capacitor, and 0.1" leaded capacitor.
C27 = ASL:CAP_POL: Capacitor Polarized These are standard SMD and PTH capacitors. Normally 10uF, 47uF, and 100uF in electrolytic and tantalum varieties. Always verify the external diameter of the through hole cap, it varies with capacity, voltage, and manufacturer. The EIA devices should be standard.
C42 = SensorCape:CAP_POL: Capacitor Polarized These are standard SMD and PTH capacitors. Normally 10uF, 47uF, and 100uF in electrolytic and tantalum varieties. Always verify the external diameter of the through hole cap, it varies with capacity, voltage, and manufacturer. The EIA devices should be standard.
IC1 = OpenPMSM:DRV8303: edit this description Auto generated by make-symbol-device-package-bsdl.ulp Rev. 43 Source:
JP1 = ASL:M06: Header 6 Standard 6-pin 0.1" header. Use with straight break away headers (SKU : PRT-00116), right angle break away headers (PRT-00553), swiss pins (PRT-00743), machine pins (PRT-00117), and female headers (PRT-00115). Molex polarized connector foot print use with SKU : PRT-08094 with associated crimp pins and housings. NOTES ON THE VARIANTS LOCK and LOCK_LONGPADS... This footprint was designed to help hold the alignment of a through-hole component (i.e. 6-pin header) while soldering it into place. You may notice that each hole has been shifted either up or down by 0.005 of an inch from it's more standard position (which is a perfectly straight line). This slight alteration caused the pins (the squares in the middle) to touch the edges of the holes. Because they are alternating, it causes a "brace" to hold the component in place. 0.005 has proven to be the perfect amount of "off-center" position when using our standard breakaway headers. Although looks a little odd when you look at the bare footprint, once you have a header in there, the alteration is very hard to notice. Also, if you push a header all the way into place, it is covered up entirely on the bottom side. This idea of altering the position of holes to aid alignment will be further integrated into the Sparkfun Library for other footprints. It can help hold any component with 3 or more connection pins.
JP3 = CMPE118lib:M06: Header 6 Standard 6-pin 0.1" header. Use with straight break away headers (SKU : PRT-00116), right angle break away headers (PRT-00553), swiss pins (PRT-00743), machine pins (PRT-00117), and female headers (PRT-00115). Molex polarized connector foot print use with SKU : PRT-08094 with associated crimp pins and housings. NOTES ON THE VARIANTS LOCK and LOCK_LONGPADS... This footprint was designed to help hold the alignment of a through-hole component (i.e. 6-pin header) while soldering it into place. You may notice that each hole has been shifted either up or down by 0.005 of an inch from it's more standard position (which is a perfectly straight line). This slight alteration caused the pins (the squares in the middle) to touch the edges of the holes. Because they are alternating, it causes a "brace" to hold the component in place. 0.005 has proven to be the perfect amount of "off-center" position when using our standard breakaway headers. Although looks a little odd when you look at the bare footprint, once you have a header in there, the alteration is very hard to notice. Also, if you push a header all the way into place, it is covered up entirely on the bottom side. This idea of altering the position of holes to aid alignment will be further integrated into the Sparkfun Library for other footprints. It can help hold any component with 3 or more connection pins.
LED1-LED6 = ASL:LED: LEDs Standard schematic elements and footprints for 5mm, 3mm, 1206, and 0603 sized LEDs. 5mm - Spark Fun Electronics SKU : COM-00529 (and others)
R1 R12-R15 R17-R20 R24-R27 = ASL:RESISTOR: Resistor Basic schematic elements and footprints for 0603, 1206, and PTH resistors.
R4 R7 = pavlo:RESISTOR: Resistor Basic schematic elements and footprints for 0603, 1206, and PTH resistors.
R5 R6 = CMPE118lib:RESISTOR: Resistor Basic schematic elements and footprints for 0603, 1206, and PTH resistors.
RN1 = ASL:RESISTOR_ARRAY-4: Chip Resistor Array 4 Single Resistor Source: http://industrial.panasonic.com/www-data/pdf/AOC0000/AOC0000PE2.pdf; OC_FARNELL: unknown; OC_NEWARK: unknown
SJ8 = jumper:SJ: SMD solder JUMPER
TP1-TP4 TP6 TP7 = testpad:TP: Test pad
U2 = pavlo:SN65HVD232_D_8
U3 = pavlo:SN65LVDT348_PW_1
U6 = OpenPMSM:DSPIC33EP256MU80
U7 = SensorCape:TPS84250_RKG_41
U9 U10 = pavlo:H1206T500R-10
U$1 U$22 = SensorCape:TPS7A4700_RGW_20
U$2 U$9-U$12 = OpenPMSM:NETJUMPER
U$3-U$8 = pavlo:PSMN013-80YS
U$14 U$19 = OpenPMSM:MICROCLASP3
U$16 = OpenPMSM:MINIFITJR4PIN
U$17 = OpenPMSM:MINIFITJR6PIN
U$18 = OpenPMSM:MICROCLASP2
U$20 = OpenPMSM:MICROCLASP5
U$21 = OpenPMSM:3M10PIN2500

## Net classes
2 small: width 0.254 mm, clearance 0.254 mm to class 1
3 Power: clearance 0.381 mm to class 0

## Board
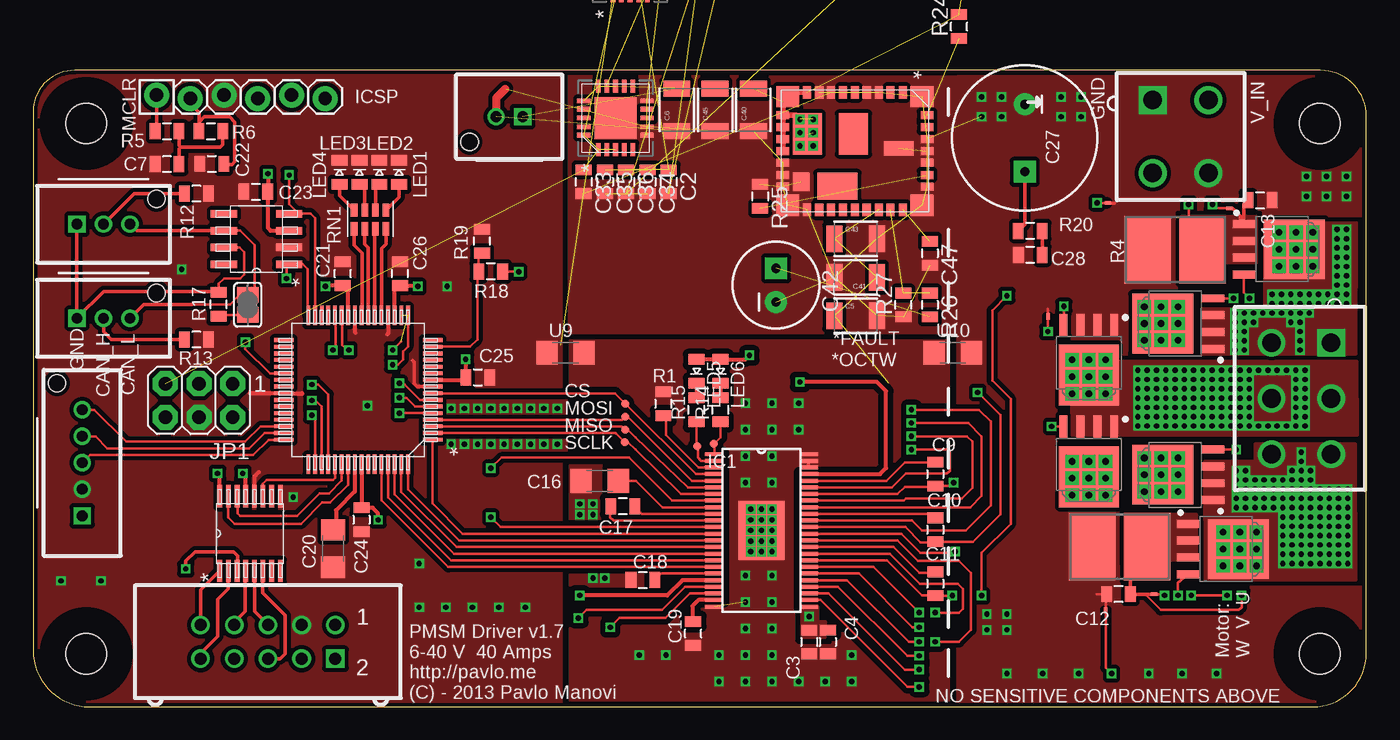
[diagram p6: board, top side]
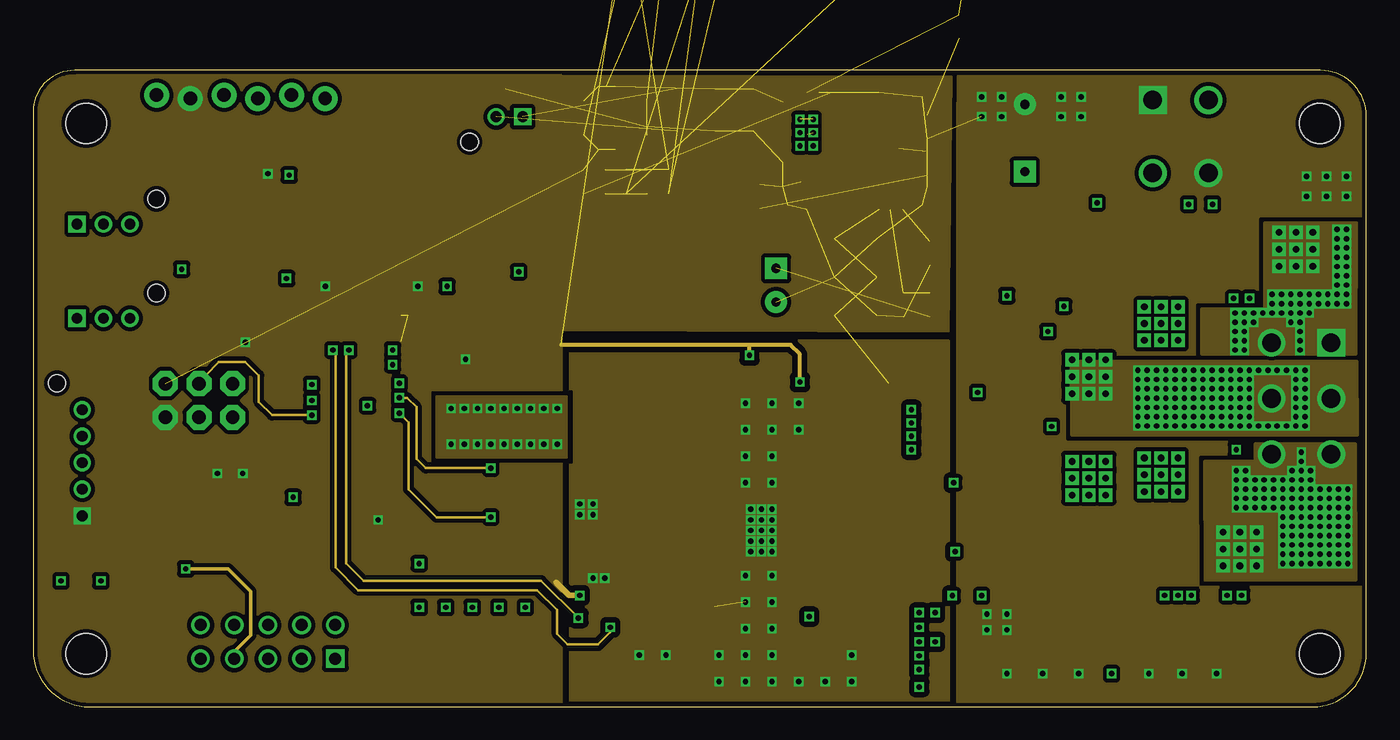
[diagram p7: board, inner layer Route2]
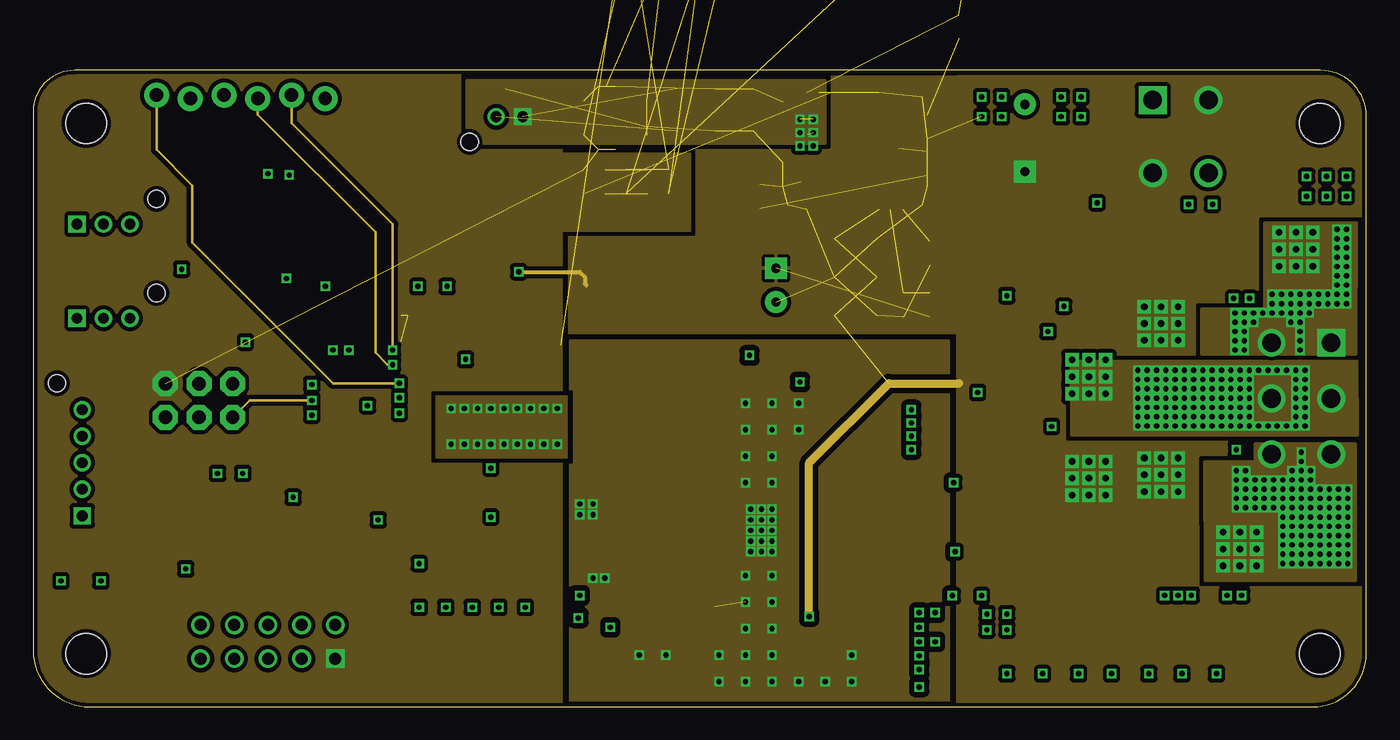
[diagram p8: board, inner layer Route15]
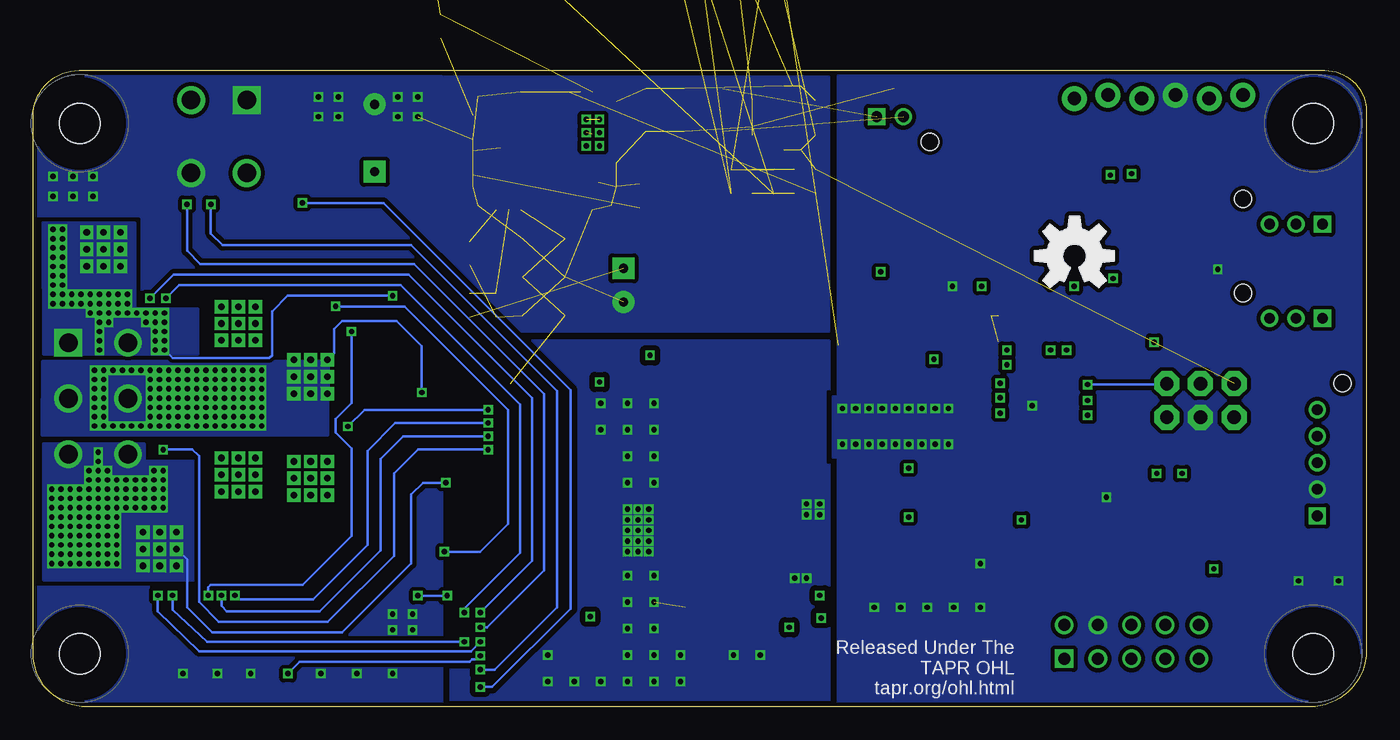
[diagram p9: board, bottom side, seen from below]

Size 100.5 x 48 mm. Coordinates in mm from the lower left corner, seen from the top.
Outline: 0,44.88 0,4.24 arc90 4.24,0 96.47,0 arc90 100.5,4.03 100.5,44.53 arc90 97.03,48 3.12,48 arc90 0,44.88
Copper layers (1*16): Top 0.035mm / dielectric 1.5mm / Bottom 0.035mm
Design rules "default": minimum track width 6mil, minimum drill 12mil, track to track 6mil, track to pad 6mil, pad to pad 6mil, via to via 6mil, smd to smd 0mil, copper to edge 10mil, drill to drill 10mil, minimum pad ring 10mil, minimum via ring 6mil, stop-mask expansion 2mil, vias tented up to drill 100mil, thermal gap 10mil

### Footprints (pad centres in the part's own frame; a part is rotated, then mirrored left to right if it is on the bottom)
0805 = smd 0.8 x 1.2: 1 -0.9,0; 2 0.9,0
1210 = smd 1.2 x 2: 1 -1.6,0; 2 1.6,0
1206 = smd 1.6 x 1.8: 1 -1.4,0; 2 1.4,0
CPOL-RADIAL-1000UF-25V = drill 0.7 pad 1.651 square: 1 2.54,0 | drill 0.7 pad 1.651: 2 -2.54,0
CPOL-RADIAL-100UF-25V = drill 0.7 pad 1.651 square: 1 1.27,0 | drill 0.7 pad 1.651: 2 -1.27,0
STAND-OFF-TIGHT = hole 3.048: 0,0
HTSSOP-480-DCA = smd 1.4 x 0.3: 1 -3.55,5.75; 2 -3.55,5.25; 3 -3.55,4.75; 4 -3.55,4.25; 5 -3.55,3.75; 6 -3.55,3.25; 7 -3.55,2.75; 8 -3.55,2.25; 9 -3.55,1.75; 10 -3.55,1.25; 11 -3.55,0.75; 12 -3.55,0.25; 13 -3.55,-0.25; 14 -3.55,-0.75; 15 -3.55,-1.25; 16 -3.55,-1.75; 17 -3.55,-2.25; 18 -3.55,-2.75; 19 -3.55,-3.25; 20 -3.55,-3.75; 21 -3.55,-4.25; 22 -3.55,-4.75; 23 -3.55,-5.25; 24 -3.55,-5.75; 25 3.55,-5.75; 26 3.55,-5.25; 27 3.55,-4.75; 28 3.55,-4.25; 29 3.55,-3.75; 30 3.55,-3.25; 31 3.55,-2.75; 32 3.55,-2.25; 33 3.55,-1.75; 34 3.55,-1.25; 35 3.55,-0.75; 36 3.55,-0.25; 37 3.55,0.25; 38 3.55,0.75; 39 3.55,1.25; 40 3.55,1.75; 41 3.55,2.25; 42 3.55,2.75; 43 3.55,3.25; 44 3.55,3.75; 45 3.55,4.25; 46 3.55,4.75; 47 3.55,5.25; 48 3.55,5.75 | smd 3.48 x 4.42: 49 0,0
2X03 = drill 1.016 pad 1.88 octagon: 1 -2.54,-1.27; 2 -2.54,1.27; 3 0,-1.27; 4 0,1.27; 5 2.54,-1.27; 6 2.54,1.27
1X06_LOCK = drill 1.016 pad 1.88: 1 0,0.127; 2 2.54,-0.127; 3 5.08,0.127; 4 7.62,-0.127; 5 10.16,0.127; 6 12.7,-0.127
LED-0805 = smd 0.8 x 1.2: 1 -0.9,0; 2 0.9,0
SMT-REF = smd 3.505 x 5.08: 1 2.134,0; 2 -2.007,0
EXB-38V271JV = smd 0.5 x 1: P$1 0,0; P$2 0.8,0; P$3 1.6,0; P$4 2.4,0; P$5 2.4,1.4; P$6 1.6,1.4; P$7 0.8,1.4; P$8 0,1.4
SJ = smd 1.168 x 1.6: 1 -0.762,0; 2 0.762,0
TP06R = smd 0.6 x 0.6: TP 0,0
D8 = smd 1.981 x 0.559: 1 -2.464,1.905; 2 -2.464,0.635; 3 -2.464,-0.635; 4 -2.464,-1.905; 5 2.464,-1.905; 6 2.464,-0.635; 7 2.464,0.635; 8 2.464,1.905
PW16 = smd 1.676 x 0.356: 1 -2.819,2.286; 2 -2.819,1.626; 3 -2.819,0.965; 4 -2.819,0.33; 5 -2.819,-0.33; 6 -2.819,-0.965; 7 -2.819,-1.626; 8 -2.819,-2.286; 9 2.819,-2.286; 10 2.819,-1.626; 11 2.819,-0.965; 12 2.819,-0.33; 13 2.819,0.33; 14 2.819,0.965; 15 2.819,1.626; 16 2.819,2.286
QFP64-10X10MC = smd 1.473 x 0.279: 1 -5.613,3.759; 2 -5.613,3.251; 3 -5.613,2.743; 4 -5.613,2.261; 5 -5.613,1.753; 6 -5.613,1.245; 7 -5.613,0.762; 8 -5.613,0.254; 9 -5.613,-0.254; 10 -5.613,-0.762; 11 -5.613,-1.245; 12 -5.613,-1.753; 13 -5.613,-2.261; 14 -5.613,-2.743; 15 -5.613,-3.251; 16 -5.613,-3.759; 33 5.613,-3.759; 34 5.613,-3.251; 35 5.613,-2.743; 36 5.613,-2.261; 37 5.613,-1.753; 38 5.613,-1.245; 39 5.613,-0.762; 40 5.613,-0.254; 41 5.613,0.254; 42 5.613,0.762; 43 5.613,1.245; 44 5.613,1.753; 45 5.613,2.261; 46 5.613,2.743; 47 5.613,3.251; 48 5.613,3.759 | smd 0.279 x 1.473: 17 -3.759,-5.613; 18 -3.251,-5.613; 19 -2.743,-5.613; 20 -2.261,-5.613; 21 -1.753,-5.613; 22 -1.245,-5.613; 23 -0.762,-5.613; 24 -0.254,-5.613; 25 0.254,-5.613; 26 0.762,-5.613; 27 1.245,-5.613; 28 1.753,-5.613; 29 2.261,-5.613; 30 2.743,-5.613; 31 3.251,-5.613; 32 3.759,-5.613; 49 3.759,5.613; 50 3.251,5.613; 51 2.743,5.613; 52 2.261,5.613; 53 1.753,5.613; 54 1.245,5.613; 55 0.762,5.613; 56 0.254,5.613; 57 -0.254,5.613; 58 -0.762,5.613; 59 -1.245,5.613; 60 -1.753,5.613; 61 -2.261,5.613; 62 -2.743,5.613; 63 -3.251,5.613; 64 -3.759,5.613
RKG41 = smd 1.6 x 1.702: 1 0,0; 11 0,-10.109; 19 8.179,-10.109; 29 8.179,0 | smd 0.94 x 0.61: 2 -0.33,-1.448; 3 -0.33,-2.362; 4 -0.33,-3.251; 5 -0.33,-4.166; 6 -0.33,-5.055; 7 -0.33,-5.944; 8 -0.33,-6.858; 9 -0.33,-7.747; 10 -0.33,-8.661; 20 8.509,-8.661; 21 8.509,-7.747; 22 8.509,-6.858; 23 8.509,-5.944; 24 8.509,-5.055; 25 8.509,-4.166; 26 8.509,-3.251; 27 8.509,-2.362; 28 8.509,-1.448 | smd 0.61 x 0.94: 12 1.397,-10.49; 13 2.286,-10.49; 14 3.2,-10.49; 15 4.089,-10.49; 16 4.978,-10.49; 17 5.893,-10.49; 18 6.782,-10.49; 30 6.782,0.381; 31 5.893,0.381; 32 4.978,0.381; 33 4.089,0.381; 34 3.2,0.381; 35 2.286,0.381; 36 1.397,0.381 | smd 1.1 x 2.25: 37 3.88,-1.75 | smd 3.1 x 2.2: 38 2.8,-5.16; 39 2.8,-8.64 | smd 1.4 x 1.24: 40 6.43,-9.11 | smd 2.04 x 3.05: 41 6.75,-6.37
RGW20_3P15X3P15 = smd 0.991 x 0.356: 1 -2.388,1.295; 2 -2.388,0.66; 3 -2.388,0; 4 -2.388,-0.66; 5 -2.388,-1.295; 11 2.388,-1.295; 12 2.388,-0.66; 13 2.388,0; 14 2.388,0.66; 15 2.388,1.295 | smd 0.356 x 0.991: 6 -1.295,-2.388; 7 -0.66,-2.388; 8 0,-2.388; 9 0.66,-2.388; 10 1.295,-2.388; 16 1.295,2.388; 17 0.66,2.388; 18 0,2.388; 19 -0.66,2.388; 20 -1.295,2.388 | smd 3.15 x 3.15: 21 0,0
NETJUMPER = smd 0.254 x 0.254: P$1 -0.1,0; P$2 0.1,0
TO127P600X120-5N = smd 1.65 x 0.6: 1 -2.65,1.905; 2 -2.65,0.635; 3 -2.65,-0.635; 4 -2.65,-1.905 | smd 4.6 x 4.5: 5 1.15,0 | drill 0.5 square: P$1 0,1.27; P$2 1.27,1.27; P$3 2.54,1.27; P$4 2.54,0; P$5 1.27,0; P$6 0,0; P$7 0,-1.27; P$8 1.27,-1.27; P$9 2.54,-1.27
55932-0310 = drill 0.8: P$1 0,0; P$3 2,0 | drill 0.8 square: P$2 -2,0 | hole 1.3: 4,1.9
0039288040 = drill 1.4 square: 1 -2.1,2.75 | drill 1.4: 2 2.1,2.75; 3 -2.1,-2.75; 4 2.1,-2.75
0039288060 = drill 1.4 square: 1 -4.2,2.25 | drill 1.4: 2 -4.2,-2.25; 3 0,2.25; 4 0,-2.25; 5 4.2,2.25; 6 4.2,-2.25
55932-0210 = drill 0.8 square: 1 -1,0 | drill 0.8: 2 1,0 | hole 1.3: 3,1.9
55932-0510 = drill 0.8 square: 1 -4,0 | drill 0.8: 2 -2,0; 3 0,0; 4 2,0; 5 4,0 | hole 1.3: 6,1.9
FOUR-WALL-2500-LP-STH = drill 0.9: 1 -5.08,-1.27; 3 -2.54,-1.27; 4 -2.54,1.27; 5 0,-1.27; 6 0,1.27; 7 2.54,-1.27; 8 2.54,1.27; 9 5.08,-1.27; 10 5.08,1.27 | drill 0.9 square: 2 -5.08,1.27

### Placement (x,y rotation side)
C1  57,78 270 top  (outside the outline)
C2  47.9,39.6 270 top
C3  58.5,4.9 270 top
C4  59.9,4.9 270 top
C5  62,29.5 0 top
C6  48.5,45 90 top
C7  10.1,40.92 180 top
C9  68,17.55 270 top
C10  68,13.35 270 top
C11  68,9.28 270 top
C12  81.81,8.5 180 top
C13  92.48,38.2 0 top
C16  42.71,17.04 180 top
C17  44.44,15.12 180 top
C18  45.97,9.57 0 top
C19  49.75,5.54 90 top
C20  22.61,11.94 270 top
C21  23.34,32.67 90 top
C22  13.47,40.94 0 top
C23  16.78,38.84 0 top
C24  24.75,14.11 270 top
C25  33.53,24.84 0 top
C26  27.65,32.67 90 top
C27  74.75,42.89 270 top
C28  75.17,34.08 180 top
C33  41.5,39.6 270 top
C34  46.3,39.6 270 top
C35  43.1,39.6 270 top
C36  44.7,39.6 270 top
C37  72,65 270 top  (outside the outline)
C38  52,70 270 top  (outside the outline)
C39  46,78 270 top  (outside the outline)
C40  54.3,45 90 top
C41  62,32.4 180 top
C42  56,31.8 90 top
C43  62,35.3 0 top
C45  51.4,45 90 top
C47  67.6,34.2 270 top
C50  46,73 270 top  (outside the outline)
C51  41,78 270 top  (outside the outline)
C52  42,73 270 top  (outside the outline)
C53  36,78 270 top  (outside the outline)
C54  36,73 270 top  (outside the outline)
E$1  [STAND-OFF-TIGHT]  4,44 0 top
E$2  [STAND-OFF-TIGHT]  4,4 0 top
E$3  [STAND-OFF-TIGHT]  97,4 0 top
E$4  [STAND-OFF-TIGHT]  97,44 0 top
IC1  54.9,13.3 0 top
JP1  12.5,23.1 180 top
JP3  9.31,46 0 top
LED1  27.6,40.3 90 top
LED2  26.1,40.3 90 top
LED3  24.6,40.3 90 top
LED4  23.1,40.3 90 top
LED5  50,25.3 270 top
LED6  51.8,25.3 270 top
R1  47.5,22.85 270 top
R4  86.16,34.47 180 top
R5  10.1,43.4 0 top
R6  13.4,43.4 0 top
R7  81.96,12.07 180 top
R12  12.3,38.7 180 top
R13  12.3,27.7 180 top
R14  51.8,22.4 90 top
R15  50,22.4 90 top
R17  13.97,30.35 90 top
R18  34.49,32.83 180 top
R19  33.83,35.12 90 top
R20  75.16,35.88 180 top
R24  69.8,51.3 90 top
R25  54.8,38.5 270 top
R26  67.6,30.3 270 top
R27  65.6,30.3 90 top
RN1  24.2,36.05 0 top
SJ8  16.18,30.31 90 top
TP1  44.63,22.87 0 top
TP2  44.62,21.87 0 top
TP3  44.62,20.9 0 top
TP4  44.6,19.95 0 top
TP6  51.32,19.83 90 top
TP7  50.06,19.65 270 top
U2  16.84,35.27 180 top
U3  16.35,13.07 90 top
U6  24.5,23.9 180 top
U7  67,46 270 top
U9  40.13,26.7 0 top
U10  69.32,26.7 0 top
U$1  43.9,44.4 90 top
U$2  80.85,7.29 90 top
U$3  86.3,17.5 180 top
U$4  79.58,18.5 270 top
U$5  86.3,28.9 180 top
U$6  89.69,11.9 0 top
U$7  79.58,26.16 270 top
U$8  93.92,34.5 0 top
U$9  84.5,8.5 0 top
U$10  76.5,29.45 90 top
U$11  81,38 0 top
U$12  90.16,37.6 180 top
U$14  5.3,29.3 0 top
U$16  86.5,43 0 top
U$17  95.6,23.25 270 top
U$18  35.9,44.5 180 top
U$19  5.3,36.4 0 top
U$20  3.7,18.4 90 top
U$21  17.7,4.9 180 top
U$22  45,56 90 top  (outside the outline)

### Tracks (layer width: path | path; a pad name or v marks a point on that pad's centre or on a via)
*SCS
  Top 0.203: IC1.4 49.95,17.55 TP1.TP | TP1.TP | U6.8 43.85,23.65 TP1.TP
BST_B
  Top 0.203: IC1.39 67.59,14.55 C10.1
BST_C
  Top 0.203: IC1.34 64.85,12.05 66.8,10.1 67.92,10.1 C11.1
CAN_H
  Top 0.203: U2.7 15.56,34.63 15.9,34.3 15.9,32.6 15.6,32.3 14.4,32.3 14,31.9 14,31.28 R17.2 13.92,31.3
  Top 0.254: 13.92,31.3 5.3,31.3 U$14.P$2 U$19.P$2
CAN_L
  Top 0.203: U2.6 15.6,35.91 16.7,34.8 16.7,30.9 16.35,30.9 SJ8.2 | 16.5,31.1 16.6,31 16.05,31 SJ8.2 | SJ8.2 15.56,31.07 14.84,30.35 11.95,30.35
  Top 0.254: U2.6 7.79,35.91 U$19.P$3 | 11.95,30.35 8.35,30.35 U$14.P$3
CANRX  (via drill 0.4)
  Top 0.203: U2.4 19.33,37.2 20,37.2 | U6.31 21.25,36.85 20.9,37.2 20,37.2 | v19.3,40.1 19.3,37.9 20,37.2
CANTX  (via drill 0.4)
  Top 0.203: U6.32 20.69,29.46 20.69,33.01 20.3,33.4 19.34,33.4 U2.1 | 19.37,33.3 U2.1 | v19.1,32.3 19.1,33.16 U2.1
CH_A+
  Top 0.254: U$21.6 18.63,3.63 19,4 19,6.9 17.3,8.6 17.3,10.23 U3.6
CH_A-
  Top 0.254: U3.5 16.68,7.19 U$21.5
CH_B+  (via drill 0.4)
  Top 0.254: v11.5,10.4 11.5,11 12.2,11.7 15.1,11.7 15.4,11.4 15.4,10.27 U3.3
  Route2 0.254: U$21.8 15.16,4.16 16.4,5.4 16.4,8.7 14.7,10.4 v11.5,10.4
CH_B-
  Top 0.254: U$21.7 15.16,6.36 16,7.2 16,10.23 U3.4
CH_I+
  Top 0.254: U$21.10 12.62,4.02 13.9,5.3 13.9,8.1 14.7,8.9 14.7,10.23 U3.2
CH_I-
  Top 0.254: U$21.9 12.62,8.81 U3.1
CRNT1  (via drill 0.4)
  Top 0.203: IC1.21 49.15,9.05 47.4,7.3 41.7,7.3 v41.1,6.7 | v23.8,26.9 23.7,26.9 23.3,27.3 23.3,29.47 U6.27
  Route2 0.203: v41.1,6.7 38.3,9.5 24.9,9.5 23.6,10.8 23.6,26.7 v23.8,26.9
CRNT2  (via drill 0.4)
  Top 0.203: IC1.22 49.52,8.55 47.67,6.7 44.2,6.7 v43.5,6 | v22.6,26.9 22.6,27.1 22.8,27.3 22.8,29.46 U6.28
  Route2 0.203: v22.6,26.9 22.8,26.6 22.8,10.5 24.5,8.8 38,8.8 39.5,7.3 39.5,5.5 40.3,4.7 42.6,4.7 43.5,5.6 v43.5,6
DC_CAL  (via drill 0.4)
  Top 0.203: IC1.8 48.15,15.55 44.9,18.8 35.3,18.8 v34.5,18 | v27.6,23.3 28.15,23.3 28.79,22.66 U6.6
  Route2 0.203: v34.5,18 29.6,18 28.9,18.7 28.9,22.6 28.2,23.3 v27.6,23.3
DRV_GND  (via drill 0.4)  (1 unrouted)
  Top 0.254: IC1.46 IC1.47
  other vias: 54.9,13.3 55.7,13.3 55.7,12.5 54.9,12.5 54.1,12.5 54.1,13.3 54.1,14.1 54.9,14.1 55.7,14.1 54.1,14.9 54.9,14.9 55.7,14.9 55.7,11.7 54.9,11.7 54.1,11.7 55.7,16.9 53.7,16.9 53.7,18.9 55.7,18.9 55.7,9.9 53.7,9.9 55.7,7.9 53.7,7.9 55.7,20.9 53.7,20.9 41.2,15.3 42.2,9.7 41.2,14.5 42.2,15.3 42.2,14.5 43.1,9.7 53.7,5.9 55.7,5.9 53.7,3.9 55.7,3.9 53.7,1.9 55.7,1.9 51.7,3.9 51.7,1.9 57.7,1.9 55.7,22.9 53.7,22.9 57.7,22.9 57.7,20.9 47.7,3.9 45.7,3.9 59.7,1.9 61.7,1.9 61.7,3.9
  pour Top (isolate 0.406, rank 4, no thermals): 40.5,0 69,0 69,27.6 40.5,27.63
  pour Bottom (isolate 0.406, rank 4): 40.5,0 69,0 69,27.6 40.5,27.6
  pour Route2 (isolate 0.406, rank 4): 40.5,0 69,0 69,27.6 40.5,27.6
  pour Route15 (isolate 0.406, rank 4): 40.5,0 69,0 69,27.6 40.5,27.6
EN_GATE  (via drill 0.4)
  Top 0.203: IC1.12 35.25,13.55 v34.5,14.3 | v27.61,22.15 U6.5
  Route2 0.203: v34.5,14.3 30.4,14.3 28.3,16.4 28.3,21.46 v27.61,22.15
EXT1  (via drill 0.4)
  Top 0.203: U6.52 22.24,23.56 21.5,24.3 v21,24.3
  Bottom 0.203: v21,24.3 15.11,24.3 JP1.1
EXT2  (via drill 0.4)
  Top 0.203: U6.51 21.76,22.64 21.3,23.1 v21,23.1
  Route15 0.203: v21,23.1 16.31,23.1 JP1.2
EXT3  (via drill 0.4)
  Top 0.203: U6.50 21.25,21.75 v21,22
  Route2 0.203: v21,22 18,22 17,23 17,25 16,26 14,26 13,25 13,24.87 JP1.3
GH_A  (via drill 0.4)
  Top 0.203: IC1.43 64.75,16.55 65.8,17.6 68.9,17.6 69.1,17.8 69.1,19.2 68.9,19.4 v66.2,19.4 | U$3.4 v90.69,19.41 v90.7,19.4
  Bottom 0.203: v90.7,19.4 88.5,19.4 88,18.9 88,7.9 86.5,6.4 78.3,6.4 73.3,11.4 73.3,17.6 71.5,19.4 v66.2,19.4
GH_B  (via drill 0.4)
  Top 0.203: IC1.38 66.25,14.05 67,13.3 70.3,13.3 72.2,15.2 72.2,21.5 71.3,22.4 v66.2,22.4 | v76.78,21.14 U$4.4
  Top 0.254: U$4.4 77.67,21.12 77.7,21.1
  Bottom 0.203: v66.2,22.4 75.52,22.4 v76.78,21.14
GH_C  (via drill 0.4)
  Top 0.203: IC1.33 64.58,11.55 66.85,9.28 69.72,9.28 70.1,8.9 70.1,7.4 69.8,7.1 v68,7.1 | v90.5,30.8 U$5.4
  Bottom 0.203: v68,7.1 68,7.4 63.8,11.6 63.8,22.8 72.8,31.8 89.5,31.8 v90.5,30.8
GL_A  (via drill 0.4)
  Top 0.203: IC1.41 65.65,15.55 65.8,15.7 70,15.7 70.8,16.5 70.8,20 70.4,20.4 v66.2,20.4 | 86.9,9.86 U$6.4 | 86.8,9.76 U$6.4 | v86.3,8.4 86.3,9.36 U$6.4
  Bottom 0.203: v86.3,8.4 86.3,7.6 85.9,7.2 78.9,7.2 74.3,11.8 74.3,18.7 72.6,20.4 v66.2,20.4
GL_B  (via drill 0.4)
  Top 0.203: IC1.36 65.45,13.05 66.9,11.6 69.1,11.6 v69.5,11.7 | v77.7,30.2 77.7,28.84 U$7.4
  Bottom 0.203: v69.5,11.7 66.8,11.7 64.7,13.8 64.7,22.4 72.5,30.2 v77.7,30.2
GL_C  (via drill 0.4)
  Top 0.203: IC1.31 63.35,10.55 v66.8,7.1 | v91.7,30.8 91.27,31.23 U$8.4
  Bottom 0.203: v66.8,7.1 62.9,11 62.9,23.3 72.2,32.6 89.9,32.6 v91.7,30.8
GND  (via drill 0.4)
  Top 0.254: U6.9 28.95,24.15 28.7,24.4 28.7,26 28.6,26.1
  Top 0.305: 16.33,23.65 U6.41 20.25,23.65 20.3,23.6 | U6.20 26.76,28.16 26.7,28.1 | U6.25 24.25,28.25 24.3,28.2 | U3.12 16.68,17.38 17,17.7
  other vias: 39.5,19.8 38.5,19.8 37.5,19.8 36.5,19.8 35.5,19.8 34.5,19.8 33.5,19.8 32.5,19.8 31.5,19.8 31.5,22.5 32.5,22.5 34.5,22.5 33.5,22.5 35.5,22.5 36.5,22.5 37.5,22.5 38.5,22.5 39.5,22.5 31.2,31.7 2.1,9.5 5.1,9.5 29.1,7.5 31.1,7.5 33.1,7.5 35.1,7.5 37.1,7.5 29.1,10.8 19.6,15.8 25.2,22.7 11.2,33
  pour Top (isolate 0.305, no thermals): 0,47.6 39.8,47.6 39.8,0 0,0
  pour Bottom (isolate 0.305, rank 2, no thermals): 0,47.6 39.8,47.6 39.8,0 0,0
  pour Top (isolate 0.305): 30.4,23.4 40.2,23.4 40.2,18.8 30.4,18.8
  pour Bottom (isolate 0.305): 30.4,23.4 40.2,23.4 40.2,18.8 30.4,18.8
  pour Route2 (isolate 0.305): 30.4,23.4 40.2,23.4 40.2,18.8 30.4,18.8
  pour Route15 (isolate 0.305): 30.4,23.4 40.2,23.4 40.2,18.8 30.4,18.8
HALL1
  Top 0.203: U6.48 17.74,20.14 16.6,19 4.3,19 U$20.3
HALL2
  Top 0.203: U6.47 17.45,20.65 16.3,19.5 5.6,19.5 4.7,20.4 U$20.4
HALL3
  Top 0.203: U$20.5 4.6,22.4 7,20 16,20 17.16,21.16 U6.46
LED1
  Top 0.254: U6.21 26.25,34.55 26.6,34.9 RN1.P$4
LED2
  Top 0.254: U6.22 25.75,35.99 RN1.P$3
LED3
  Top 0.254: U6.23 25.26,34.64 25,34.9 RN1.P$2
LED4
  Top 0.203: 24.8,29.56 U6.24
  Top 0.254: 24.8,29.56 24.8,34.2 24.2,34.8 RN1.P$1
MCLR  (via drill 0.4)
  Top 0.203: U6.7 29.16,23.14 28,24.3 27.7,24.3 v27.6,24.4
  Top 0.254: JP3.1 9.31,43.51 R5.1
  Route15 0.203: JP3.1 9.3,46.12 9.3,42 12,39.3 12,35 22.6,24.4 v27.6,24.4
MISO
  Top 0.203: IC1.6 49.35,16.55 45.4,20.3 44.8,20.9 TP3.TP 44.36,21.16 U6.3
MOSI
  Top 0.203: IC1.5 49.65,17.05 44.83,21.87 TP2.TP 44.39,21.64 U6.4
N$1
  Top 0.203: IC1.3 50.15,18.05 47.7,20.5 47.7,21.75 R1.2
N$2
  Top 0.254: R6.2 14.3,42.4 14.1,42.2 11.1,42.2 | 11.1,42.2 11,42.3 R5.2 | C7.1 11,42.1 11.1,42.2
N$3
  Bottom 0.2: 22.79,32.09 arc9 23.09,32.25 23.85,31.64 24.36,32.15 23.75,32.91 arc19 24.01,33.54 24.98,33.63 24.98,34.37 24.01,34.46 arc19 23.75,35.09 24.36,35.85 23.85,36.36 23.09,35.75 arc19 22.46,36.01 22.37,36.98 21.63,36.98 21.54,36.01 arc19 20.91,35.75 20.15,36.36 19.64,35.85 20.25,35.09 arc19 19.99,34.46 19.02,34.37 19.02,33.63 19.99,33.54 arc19 20.25,32.91 19.64,32.15 20.15,31.64 20.91,32.25 arc9 21.21,32.09 21.64,33.13 arc-68 21.06,34 arc-248 22.36,33.13 22.79,32.09
N$4
  Top 0.203: IC1.44 64.34,17.05 65.73,18.44 C9.1
N$5  (1 unrouted)
N$6
  Top 0.254: R20.1 C28.1
N$8  (1 unrouted)
N$11
  Top 0.305: LED5.2 R15.2
N$12
  Top 0.203: IC1.1 51.35,19.8 TP6.TP 51.8,20.31 R14.1
N$17
  Top 0.305: LED6.2 R14.2
N$18
  Top 0.203: IC1.9 47.45,15.05 45.46,17.04 C16.1
N$19
  Top 0.203: IC1.10 45.91,14.55 C17.1
N$20
  Top 0.203: IC1.11 43.75,14.05 43.5,14.3 43.5,15.08 C17.2
N$21
  Top 0.203: IC1.19 47.35,10.05 C18.2
N$22
  Top 0.305: IC1.23 50.15,8.05 49.7,7.6 49.7,6.49 C19.2
N$23  (1 unrouted)
N$24
  Top 0.203: IC1.2 50.35,18.55 50.1,18.8 50.1,19.61 TP7.TP 50,19.71 R15.1
N$25
  Top 0.203: R19.1 33.59,33.98 R18.2 33.5,32.74 33.5,27.7 32.95,27.15 U6.15
N$27
  Top 0.254: R12.2 7.6,38.7 U$19.P$1
N$28
  Top 0.254: U$14.P$1 5.3,28.3 5.9,27.7 R13.2
N$31
  Top 0.305: U6.56 24.25,16.24 22.83,14.82 22.83,13.56 C20.1
N$37  (1 unrouted)
N$38  (1 unrouted)
N$41  (2 unrouted)
N$43  (1 unrouted)
N$44
  Top 0.254: LED1.1 27.6,38.45 RN1.P$5
N$45
  Top 0.254: RN1.P$6 25.8,39.1 LED2.1
N$46
  Top 0.254: RN1.P$7 25,39 LED3.1
N$47
  Top 0.254: LED4.1 23.1,38.55 RN1.P$8
N$64
  Top 0.203: SJ8.1 14.07,29.55 R17.1
PGC  (via drill 0.4)  (1 unrouted)
  Top 0.203: 27.75,27.55 v27.1,26.9
  Route15 0.203: v27.1,26.9 27.1,36.4 19.47,44.03 JP3.5
  Route15 0.254: 19.4,46.06 JP3.5
PGD  (via drill 0.4)  (1 unrouted)
  Top 0.203: 28.26,29.51 28.26,27.16 27.9,26.8 27.9,26.2 27.5,25.8 v27.1,25.8
  Route15 0.203: JP3.4 16.93,44.67 25.8,35.8 25.8,26.7 26.7,25.8 v27.1,25.8
PGND  (via drill 0.4)  (51 unrouted)
  Top 0.203: U$10.P$2 76.5,30 | 80.2,8.5 C12.2 80.85,8.44 U$2.P$2
  Top 0.254: U$11.P$2 81.5,38
  Top 0.61: 35.6,46.6 34.9,45.9 U$18.2
  other vias: 73.4,2.5 76.1,2.5 78.8,2.5 84.1,2.5 86.6,2.5 89.2,2.5 71.5,46 77.5,46 77.5,44.5 79,44.5 79,46 73,46 73,44.5 71.5,44.5 99,40 97.5,40 96,40 96,38.5 97.5,38.5 99,38.5 71.9,7 73.4,7 73.4,5.8 71.9,5.8
  pour Top (isolate 0.305, rank 4, no thermals): 69.7,47.5 100.5,47.5 100.5,0.1 69.7,0.1
  pour Bottom (isolate 0.305, rank 4, no thermals): 69.7,47.5 100.5,47.5 100.5,0.1 69.7,0.1
  pour Route2 (isolate 0.305, rank 4, no thermals): 69.7,47.5 100.5,47.5 100.5,0.1 69.7,0.1
  pour Top (isolate 0.305, rank 3, no thermals): 40.4,47.6 40.4,28.2 70.17,28.2 70.18,47.52
  pour Bottom (isolate 0.305, rank 3, no thermals): 40.5,47.5 40.5,28.3 70,28.3 70.08,47.54
PVDD  (via drill 0.4)  (5 unrouted)
  Top 0.203: 36.57,32.83 R18.1
  Top 0.254: U$5.P$5 U$5.5 | U$3.P$5 84.3,17.5 85.3,16.5 85.3,17.35 U$3.5 | U$4.5 U$4.P$5 U$4.P$9 | R20.2 74.75,36.37 C27.1
  Top 0.305: 36.57,32.83 v36.6,32.8
  Route15 0.305: v36.6,32.8 41.2,32.8 41.6,32.4 41.6,31.9 41.7,31.8
  Route15 0.61: v58.5,6.8 58.5,18.4 64.5,24.4 69.8,24.4
  pour Top (rank 2, no thermals): 59.71,6.42 59.13,6.42 59.13,7.59 57.96,7.6 57.95,7.61 57.95,5.34 58.05,5.24 59.65,5.23 59.7,5.23
  pour Route15 (isolate 0.305, rank 4, no thermals): 69.7,47.5 100.5,47.5 100.5,0.1 69.7,0.1
  pour Route15 (isolate 0.305, rank 4): 69.9,47.53 40.4,47.6 40.4,28.2 69.9,28.2
PWM1H
  Top 0.203: IC1.13 32.39,13.05 30.12,15.32 30.12,19.83 U6.1
PWM1L
  Top 0.203: IC1.14 32.1,12.55 28.26,16.39 28.26,17.99 U6.64
PWM2H
  Top 0.203: IC1.15 31.91,12.05 27.75,16.21 27.75,17.98 U6.63
PWM2L
  Top 0.203: IC1.16 31.72,11.55 27.24,16.03 27.24,17.98 U6.62
PWM3H
  Top 0.203: IC1.17 31.49,11.05 26.76,15.78 26.76,17.99 U6.61
PWM3L
  Top 0.203: IC1.18 31.28,10.55 26.26,15.57 26.26,17.98 U6.60
QEI_A
  Top 0.203: U6.55 23.74,16.74 22.4,15.4 21.8,15.4 20.2,13.8 15.2,13.8 14.7,14.3 14.7,15.87 U3.15
QEI_B
  Top 0.203: U6.54 23.25,17.05 22.3,16.1 21.6,16.1 19.9,14.4 15.6,14.4 15.4,14.6 15.4,15.87 U3.14
QEI_I
  Top 0.203: U6.53 22.75,17.25 22.6,17.1 17.6,17.1 17.3,16.8 17.3,15.9 U3.11
SCLK
  Top 0.203: IC1.7 48.85,16.05 45.4,19.4 44.85,19.95 TP4.TP | 43.95,20.6 TP4.TP | U6.2 43.9,20.65 TP4.TP
SH_A  (via drill 0.4, 0.4 pad 0.25)
  Top 0.203: IC1.42 65.15,16.05 65.7,16.6 67.95,16.6 C9.2 69.15,16.65 v69.4,16.9
  Bottom 0.203: v69.4,16.9 71.1,16.9 72,16 72,10.8 77.2,5.6 87,5.6 88.9,7.5 88.9,11.11 U$6.P$6
  other vias: 90.7,17.81 90.7,15.71 90.7,17.11 90.7,16.41 91.4,17.81 91.4,17.11 91.4,16.41 91.4,15.71 91.4,15.01 92.1,15.01 92.1,15.71 92.1,16.41 92.1,17.11 97,16.41 97.7,16.41 98.4,16.41 99.1,16.41 99.1,15.71 98.4,15.71 97.7,15.71 97,15.71 97,15.01 97.7,15.01 98.4,15.01 99.1,15.01 99.1,14.31 98.4,14.31 98.4,13.61 99.1,13.61 98.4,12.91 99.1,12.91 98.4,12.21 99.1,12.21 98.4,11.51 99.1,11.51 98.4,10.81 99.1,10.81 95.6,18.51 95.6,19.21 92.8,15.01 92.8,15.71 92.8,17.11 92.8,16.41 93.5,17.11 93.5,16.41 93.5,15.71 93.5,15.01 94.2,15.01 94.2,15.71 94.2,16.41 94.2,17.11 94.9,17.81 94.9,15.01 94.9,15.71 94.9,17.11 94.9,16.41 95.6,17.81 95.6,17.11 95.6,16.41 95.6,15.71 95.6,15.01 96.3,15.01 96.3,15.71 96.3,16.41 96.3,17.11 96.3,17.81 94.2,14.31 94.2,11.51 94.2,12.21 94.2,13.61 94.2,12.91 94.9,14.31 94.9,13.61 94.9,12.91 94.9,12.21 94.9,11.51 95.6,11.51 95.6,12.21 95.6,12.91 95.6,13.61 95.6,14.31 94.2,10.81 94.9,10.81 95.6,10.81 96.3,14.31 96.3,11.51 96.3,12.21 96.3,13.61 96.3,12.91 97,14.31 97,13.61 97,12.91 97,12.21 97,11.51 97.7,11.51 97.7,12.21 97.7,12.91 97.7,13.61 97.7,14.31 96.3,10.81 97,10.81 97.7,10.81 90.7,15.01
  pour Route2 (isolate 0.254, no thermals): 88.33,18.49 92.12,18.5 92.12,19.84 99.67,19.84 99.69,9.56 88.35,9.55
  pour Bottom (isolate 0.254, no thermals): 88.34,18.49 92.12,18.5 92.14,19.84 99.69,19.84 99.69,9.56 88.36,9.55
  pour Top (isolate 0.254, no thermals): 88.32,18.49 92.12,18.5 92.13,19.84 99.68,19.84 99.7,9.56 88.35,9.55
  pour Route15 (isolate 0.254, no thermals): 88.34,18.48 92.12,18.5 92.12,19.84 99.67,19.84 99.68,9.55 88.35,9.53
SH_B  (via drill 0.4, 0.4 pad 0.25)
  Top 0.203: IC1.37 65.75,13.55 66.9,12.4 67.94,12.4 C10.2 70.85,12.45 72.9,14.5 72.9,22 v71.2,23.7
  Bottom 0.203: v71.2,23.7 71.2,27.2 73.1,29.1 77.2,29.1 77.8,28.5 77.8,26.67 U$7.P$7
  other vias: 83.98,24.68 84.68,24.68 85.38,24.68 83.28,23.28 84.68,23.98 83.98,23.98 85.38,23.98 83.28,25.38 84.68,23.28 85.38,23.28 83.98,23.28 83.28,21.18 83.28,24.68 83.28,21.88 83.28,22.58 83.98,25.38 84.68,25.38 85.38,25.38 85.38,22.58 84.68,22.58 83.98,22.58 83.98,21.88 84.68,21.88 85.38,21.88 85.38,21.18 84.68,21.18 83.98,21.18 89.58,24.68 90.28,24.68 90.98,24.68 88.88,23.28 90.28,23.98 89.58,23.98 90.98,23.98 88.88,25.38 90.28,23.28 90.98,23.28 89.58,23.28 88.88,21.18 88.88,24.68 88.88,23.98 88.88,21.88 88.88,22.58 89.58,25.38 90.28,25.38 90.98,25.38 90.98,22.58 90.28,22.58 89.58,22.58 89.58,21.88 90.28,21.88 90.98,21.88 90.98,21.18 90.28,21.18 89.58,21.18 86.78,24.68 87.48,24.68 88.18,24.68 86.08,23.28 87.48,23.98 86.78,23.98 88.18,23.98 86.08,25.38 87.48,23.28 88.18,23.28 86.78,23.28 86.08,21.18 86.08,24.68 86.08,23.98 86.08,21.88 86.08,22.58 86.78,25.38 87.48,25.38 88.18,25.38 88.18,22.58 87.48,22.58 86.78,22.58 86.78,21.88 87.48,21.88 88.18,21.88 88.18,21.18 87.48,21.18 86.78,21.18 91.68,23.28 91.68,25.38 91.68,21.18 91.68,24.68 91.68,23.98 91.68,21.88 91.68,22.58 92.38,25.38 93.08,25.38 93.78,25.38 93.78,21.18 93.08,21.18 92.38,21.18 95.18,24.68 95.88,24.68 95.88,23.98 95.18,23.98 94.48,25.38 95.88,23.28 95.18,23.28 94.48,21.18 95.18,25.38 95.88,25.38 95.88,22.58 95.18,22.58 95.18,21.88 95.88,21.88 95.88,21.18 95.18,21.18 83.28,23.98
  pour Top (isolate 0.254, no thermals): 78.27,26.03 99.77,26.03 99.8,20.5 78.3,20.5
  pour Bottom (isolate 0.254, no thermals): 78.27,26.03 99.77,26.03 99.8,20.5 78.3,20.5
  pour Route2 (isolate 0.254, no thermals): 78.27,26.03 99.77,26.03 99.8,20.5 78.3,20.5
  pour Route15 (isolate 0.254, no thermals): 78.27,26.03 99.77,26.03 99.8,20.5 78.3,20.5
SH_C  (via drill 0.4)
  Top 0.203: IC1.32 64.35,11.05 67,8.4 67.98,8.4 C11.2 v69.29,8.38 | v71.5,8.38 71.5,11.6 73.7,13.8 73.7,23.2 72.3,24.6 72.3,29.9 v73.4,31
  Bottom 0.203: v69.29,8.38 v71.5,8.38 | v73.4,31 81.3,31 82.5,29.8 82.5,26.5 82.7,26.3 90,26.3 v90.6,26.9
  other vias: 90.6,27.6 90.6,28.3 90.6,29 90.6,29.7 91.3,29.7 91.3,29 91.3,28.3 91.3,27.6 91.3,26.9 92,29.7 92,29 92.7,29.7 95.5,26.9 95.5,27.6 93.4,29.7 94.1,29.7 95.5,28.3 94.8,29 95.5,29 94.8,29.7 95.5,29.7 96.2,29.7 93.4,30.4 93.4,31.1 94.1,31.1 94.1,30.4 94.8,30.4 94.8,31.1 95.5,31.1 95.5,30.4 96.2,31.1 96.2,30.4 96.9,30.4 97.6,30.4 98.3,30.4 99,30.4 96.9,31.1 97.6,31.1 98.3,31.1 99,31.1 98.3,31.8 99,31.8 98.3,32.5 99,32.5 98.3,33.2 98.3,33.9 98.3,34.6 98.3,35.3 98.3,36 99,36 99,35.3 99,34.6 99,33.9 99,33.2
  pour Top (isolate 0.254, no thermals): 88.09,30.01 92.86,30.01 92.85,36.49 99.75,36.51 99.72,26.6 88.09,26.61
  pour Bottom (isolate 0.254, no thermals): 88.09,30.01 92.86,30.01 92.85,36.49 99.75,36.51 99.72,26.61 88.09,26.62
  pour Route2 (isolate 0.254, no thermals): 88.09,30.01 92.86,30.01 92.85,36.49 99.75,36.51 99.72,26.61 88.09,26.62
  pour Route15 (isolate 0.254, no thermals): 88.09,30.01 92.86,30.01 92.85,36.49 99.75,36.51 99.72,26.61 88.08,26.61
SL_A  (via drill 0.4)
  Top 0.203: IC1.40 70.65,15.05 71.5,15.9 71.5,20.4 70.5,21.4 v66.2,21.4 | U$9.P$2 85.2,8.5 v85.3,8.4
  Bottom 0.203: v85.3,8.4 85,8.1 79.4,8.1 75.3,12.2 75.3,19.3 73.2,21.4 v66.2,21.4
SL_B  (via drill 0.4)
  Top 0.203: IC1.35 65.15,12.55 66.7,11 69.8,11 70.7,10.1 70.7,5.8 69.8,4.9 v68,4.9 | v90,8.4 v87.3,8.4 | v76.5,28.3 U$10.P$1
  Bottom 0.203: v68,4.9 87.4,4.9 90,7.3 v90,8.4 | v87.3,8.4 87.3,9 87.1,9.2 80.2,9.2 76.5,12.9 76.5,19.5 77.7,20.7 77.7,21.7 76.5,22.9 v76.5,28.3
SL_C  (via drill 0.4)
  Top 0.203: IC1.30 62.25,10.05 66.3,6 v66.8,6 | v88.9,37.9 89.2,37.6 U$12.P$2
  Bottom 0.203: v66.8,6 66.3,6 62,10.3 62,23.6 71.8,33.4 87.9,33.4 88.9,34.4 v88.9,37.9
SN1  (via drill 0.4)
  Top 0.203: IC1.29 61.35,9.55 66,4.9 v66.8,4.9 | 83.9,8.5 83.9,8.4 85,7.3 90.9,7.3 91.1,7.5 v91.1,8.4
  Top 0.254: 84.25,11.35 84.2,11.4 84.2,11.84 R7.2 82.71,10.81 C12.1 83.9,8.5 U$9.P$1
  Bottom 0.203: v66.8,4.9 67.5,4.2 88,4.2 91.1,7.2 v91.1,8.4
  pour Top (isolate 0.254): 87.69,14.51 82.35,14.5 82.34,11.06 87.67,11.09
SN2  (via drill 0.4)
  Top 0.203: IC1.27 59.95,8.55 65.7,2.8 v66.8,2.8 | v87.1,37.9 87.1,35.54 R4.2
  Top 0.254: 88.05,34.59 R4.2 | U$12.P$1 90.4,37.6 91,37 91,36.67 U$8.1 91.27,37.89 C13.1
  Bottom 0.203: v66.8,2.8 65.7,2.8 61,7.5 61,23.8 72,34.8 86.2,34.8 87.1,35.7 v87.1,37.9
  pour Top (isolate 0.254): 92.2,36.97 86.55,36.96 86.55,33.5 92.2,33.49
SP1  (via drill 0.4)
  Top 0.203: IC1.28 60.65,9.05 65.91,3.85 v66.8,3.85 | U$2.P$1 80.85,2.95 v81.3,2.5
  Bottom 0.203: v66.8,3.85 66.85,3.85 67.1,3.6 67.4,3.6 67.6,3.4 80.4,3.4 v81.3,2.5
SP2  (via drill 0.4)
  Top 0.203: v66.8,1.5 65.9,1.5 59.35,8.05 IC1.26 | v80.2,38 U$11.P$1
  Bottom 0.203: v66.8,1.5 65.9,1.5 60,7.4 60,23.9 74.1,38 v80.2,38
VCC3V3  (via drill 0.4)  (8 unrouted)
  Top 0.203: U6.57 | U6.38 17.86,25.14 16,27 v16,27.5
  Top 0.254: JP3.2 11.85,45.45 12.5,44.8 R6.1 12.5,44.1 12.9,44.5 14.8,44.5 15.2,44.1 15.2,41.1 15,40.9 14.41,40.9 C22.2
  Top 0.305: v41.2,8.4 47.8,8.4 48.95,9.55 IC1.20 | U6.10 32.45,24.66 C25.1 32.6,24.87 v32.6,26.2 | U6.19 27.24,31.76 C26.1 28.93,31.77 v29,31.7 | U6.26 23.74,31.77 C21.1 22.1,31.77 v22.03,31.7 | U6.57 C24.1 25.6,15 26,14.6 v26,14.1 | U2.3 17.9,35.9 17.68,36.12 C23.2 17.7,38.86 v17.7,40.2 | IC1.45 63.85,17.55 64.3,18 64.3,23.8 63.6,24.5 v57.8,24.5 | LED5.1 LED6.1 53.7,26.2 v54,26.5 | U3.16 14.06,17.44 v13.9,17.6 | U3.13 16.02,17.42 v15.8,17.6
  Route2 0.305: v57.8,24.5 57.8,26.6 57.1,27.3 54,27.3 | 54,27.3 39.8,27.3 | v54,26.5 54,27.3
  Route2 0.406: v41.2,8.4 40.4,8.4 39.4,9.4
  pour Route2 (isolate 0.305, rank 2, no thermals): 0,47.6 39.8,47.6 39.8,0 0,0
  pour Route2 (isolate 0.305, rank 3, no thermals): 39.3,47.6 39.4,28.4 69,28.3 69.23,47.53
VCC5V0  (12 unrouted)
  pour Route15 (isolate 0.305, rank 2, no thermals): 0,47.6 39.8,47.6 39.8,0 0,0
  pour Route15 (isolate 0.305, no thermals): 38.6,41.7 49.5,41.7 49.5,35.9 38.6,35.9
VCC5V5  (via drill 0.4)  (10 unrouted)
  Top 0.406: U7.10 57.22,46.33 U7.11 56.51,45.62 U7.12 | U7.12 U7.13 U7.14 U7.15 | U7.12 57.5,44.6 v57.8,44.3
  other vias: 58.8,44.3 58.8,43.3 57.8,43.3 57.8,42.3 58.8,42.3
  pour Route15 (isolate 0.305, no thermals): 59.7,47.2 59.7,42.5 32.7,42.5 32.7,47.2

### Text on the board
tNames: MCLR | V_IN | ICSP | GND | GND | *FAULT | *OCTW | CAN_L | CAN_H | CS | MOSI | MISO | SCLK | Motor: / W V U | PMSM Driver v1.7 / 6-40 V 40 Amps / http://pavlo.me / (C) - 2013 Pavlo Manovi | NO SENSITIVE COMPONENTS ABOVE
bNames: Released Under The / TAPR OHL / tapr.org/ohl.html